# EasyEDA Pro project 二版平衡车pcb.epro, board PCB1
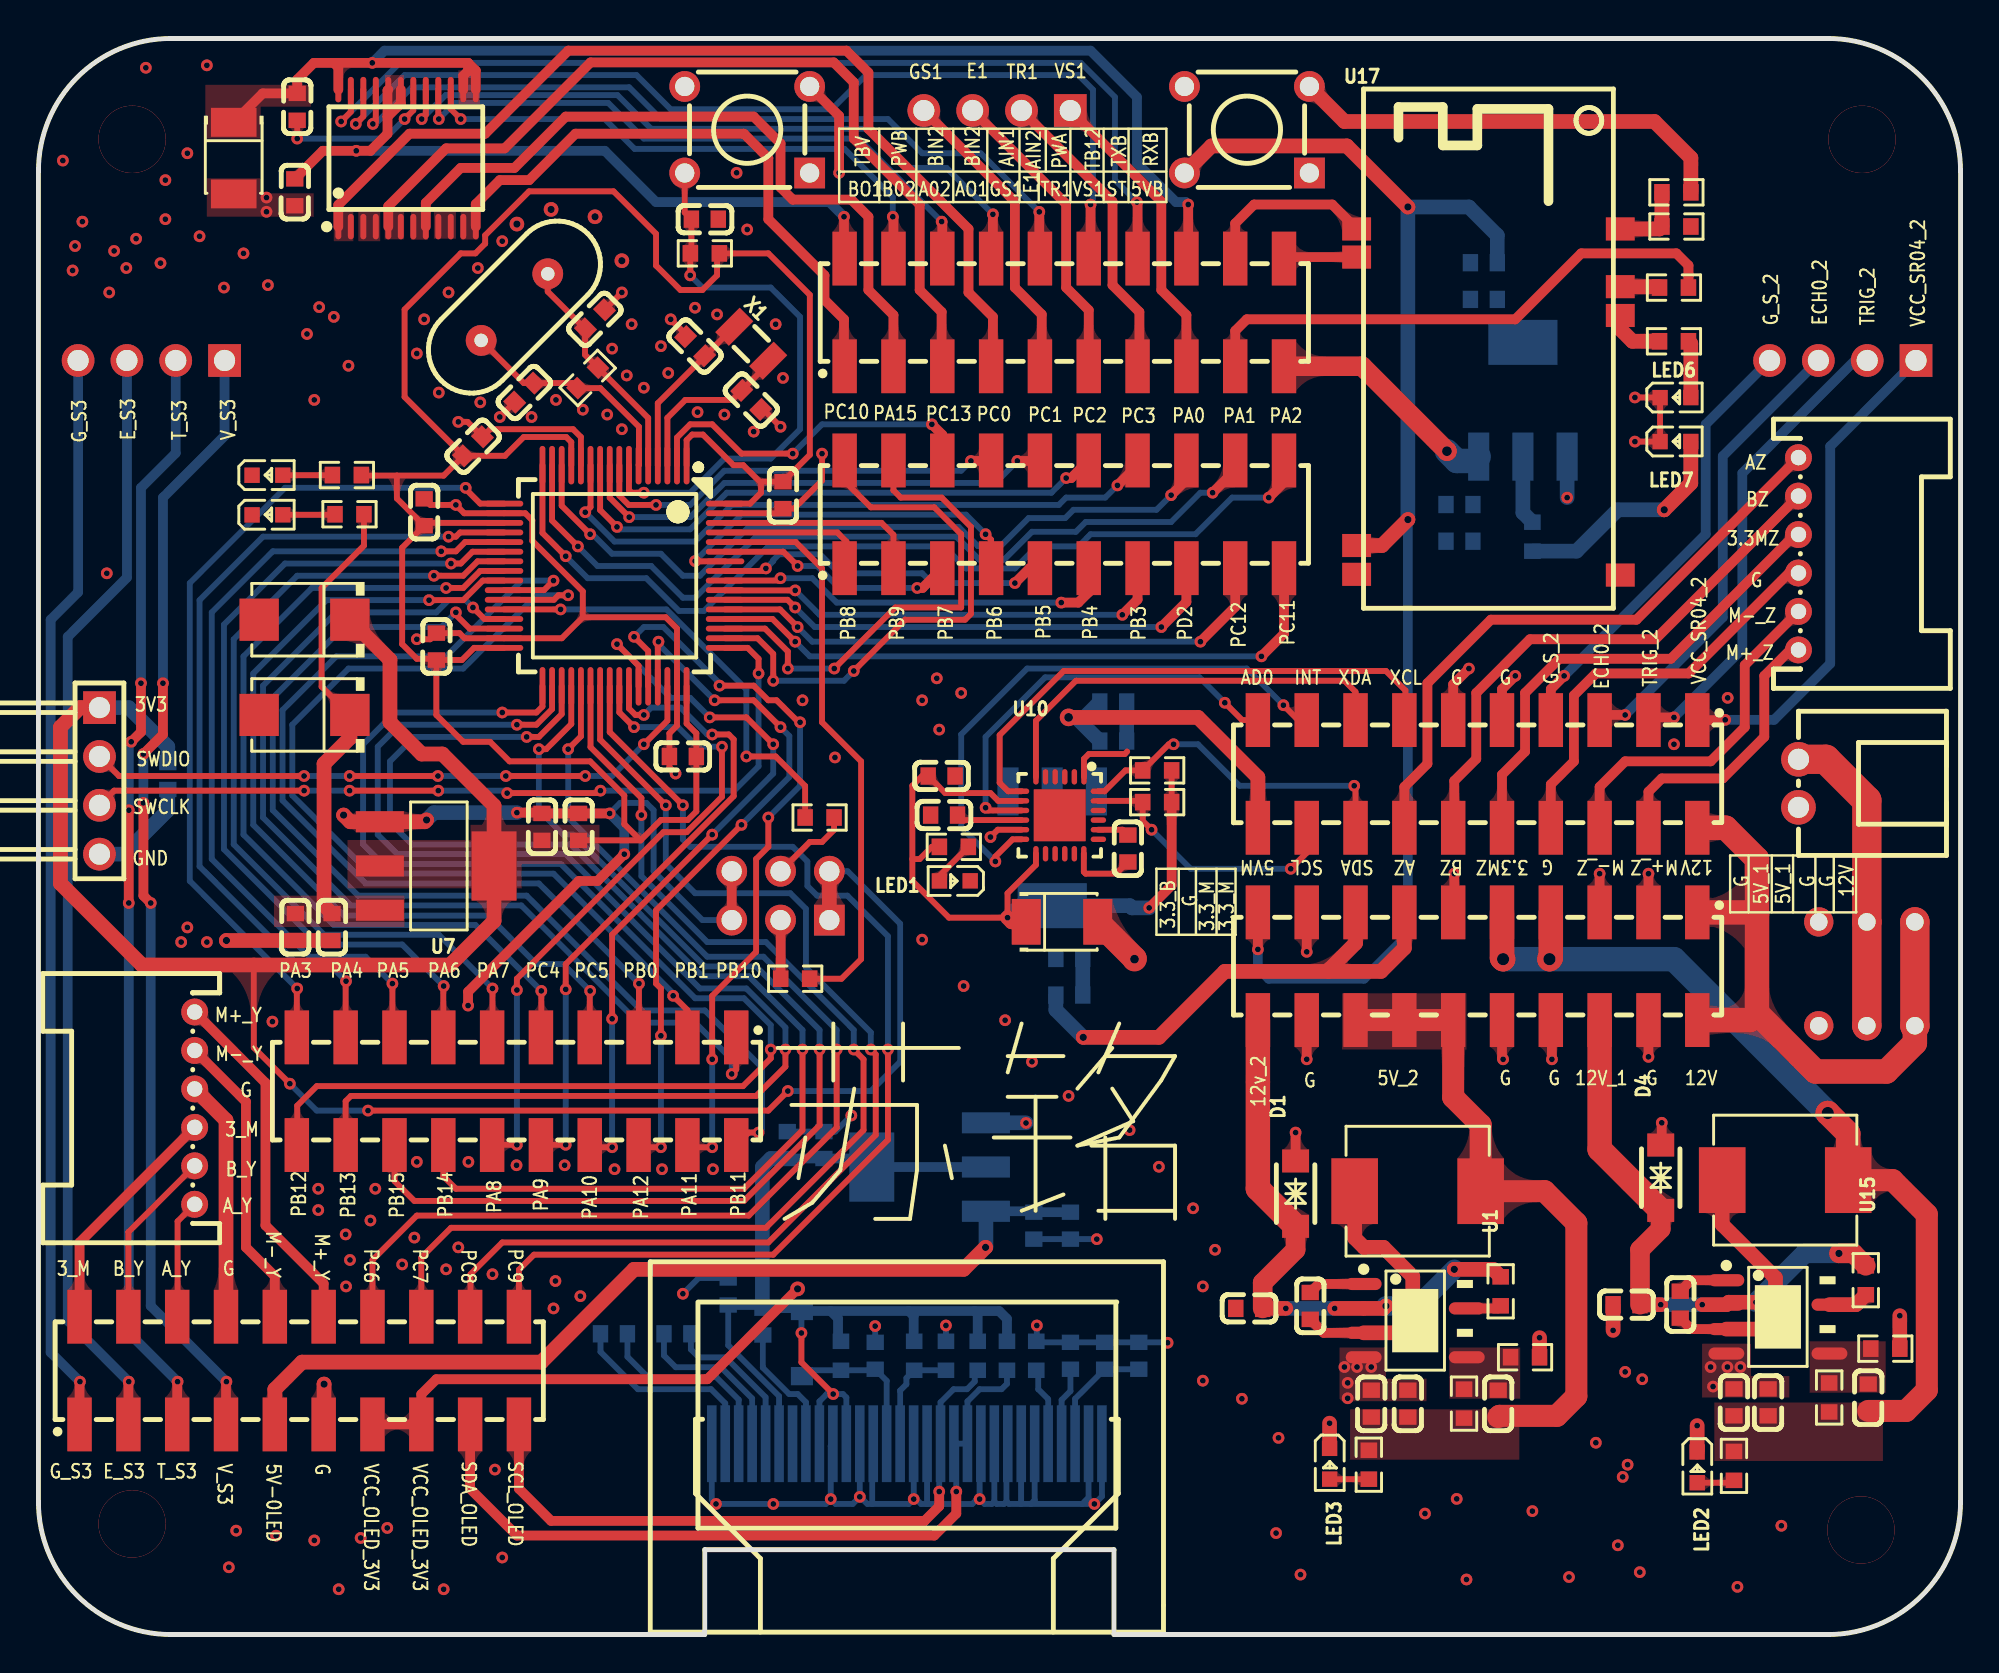
[diagram p6: board, top side]
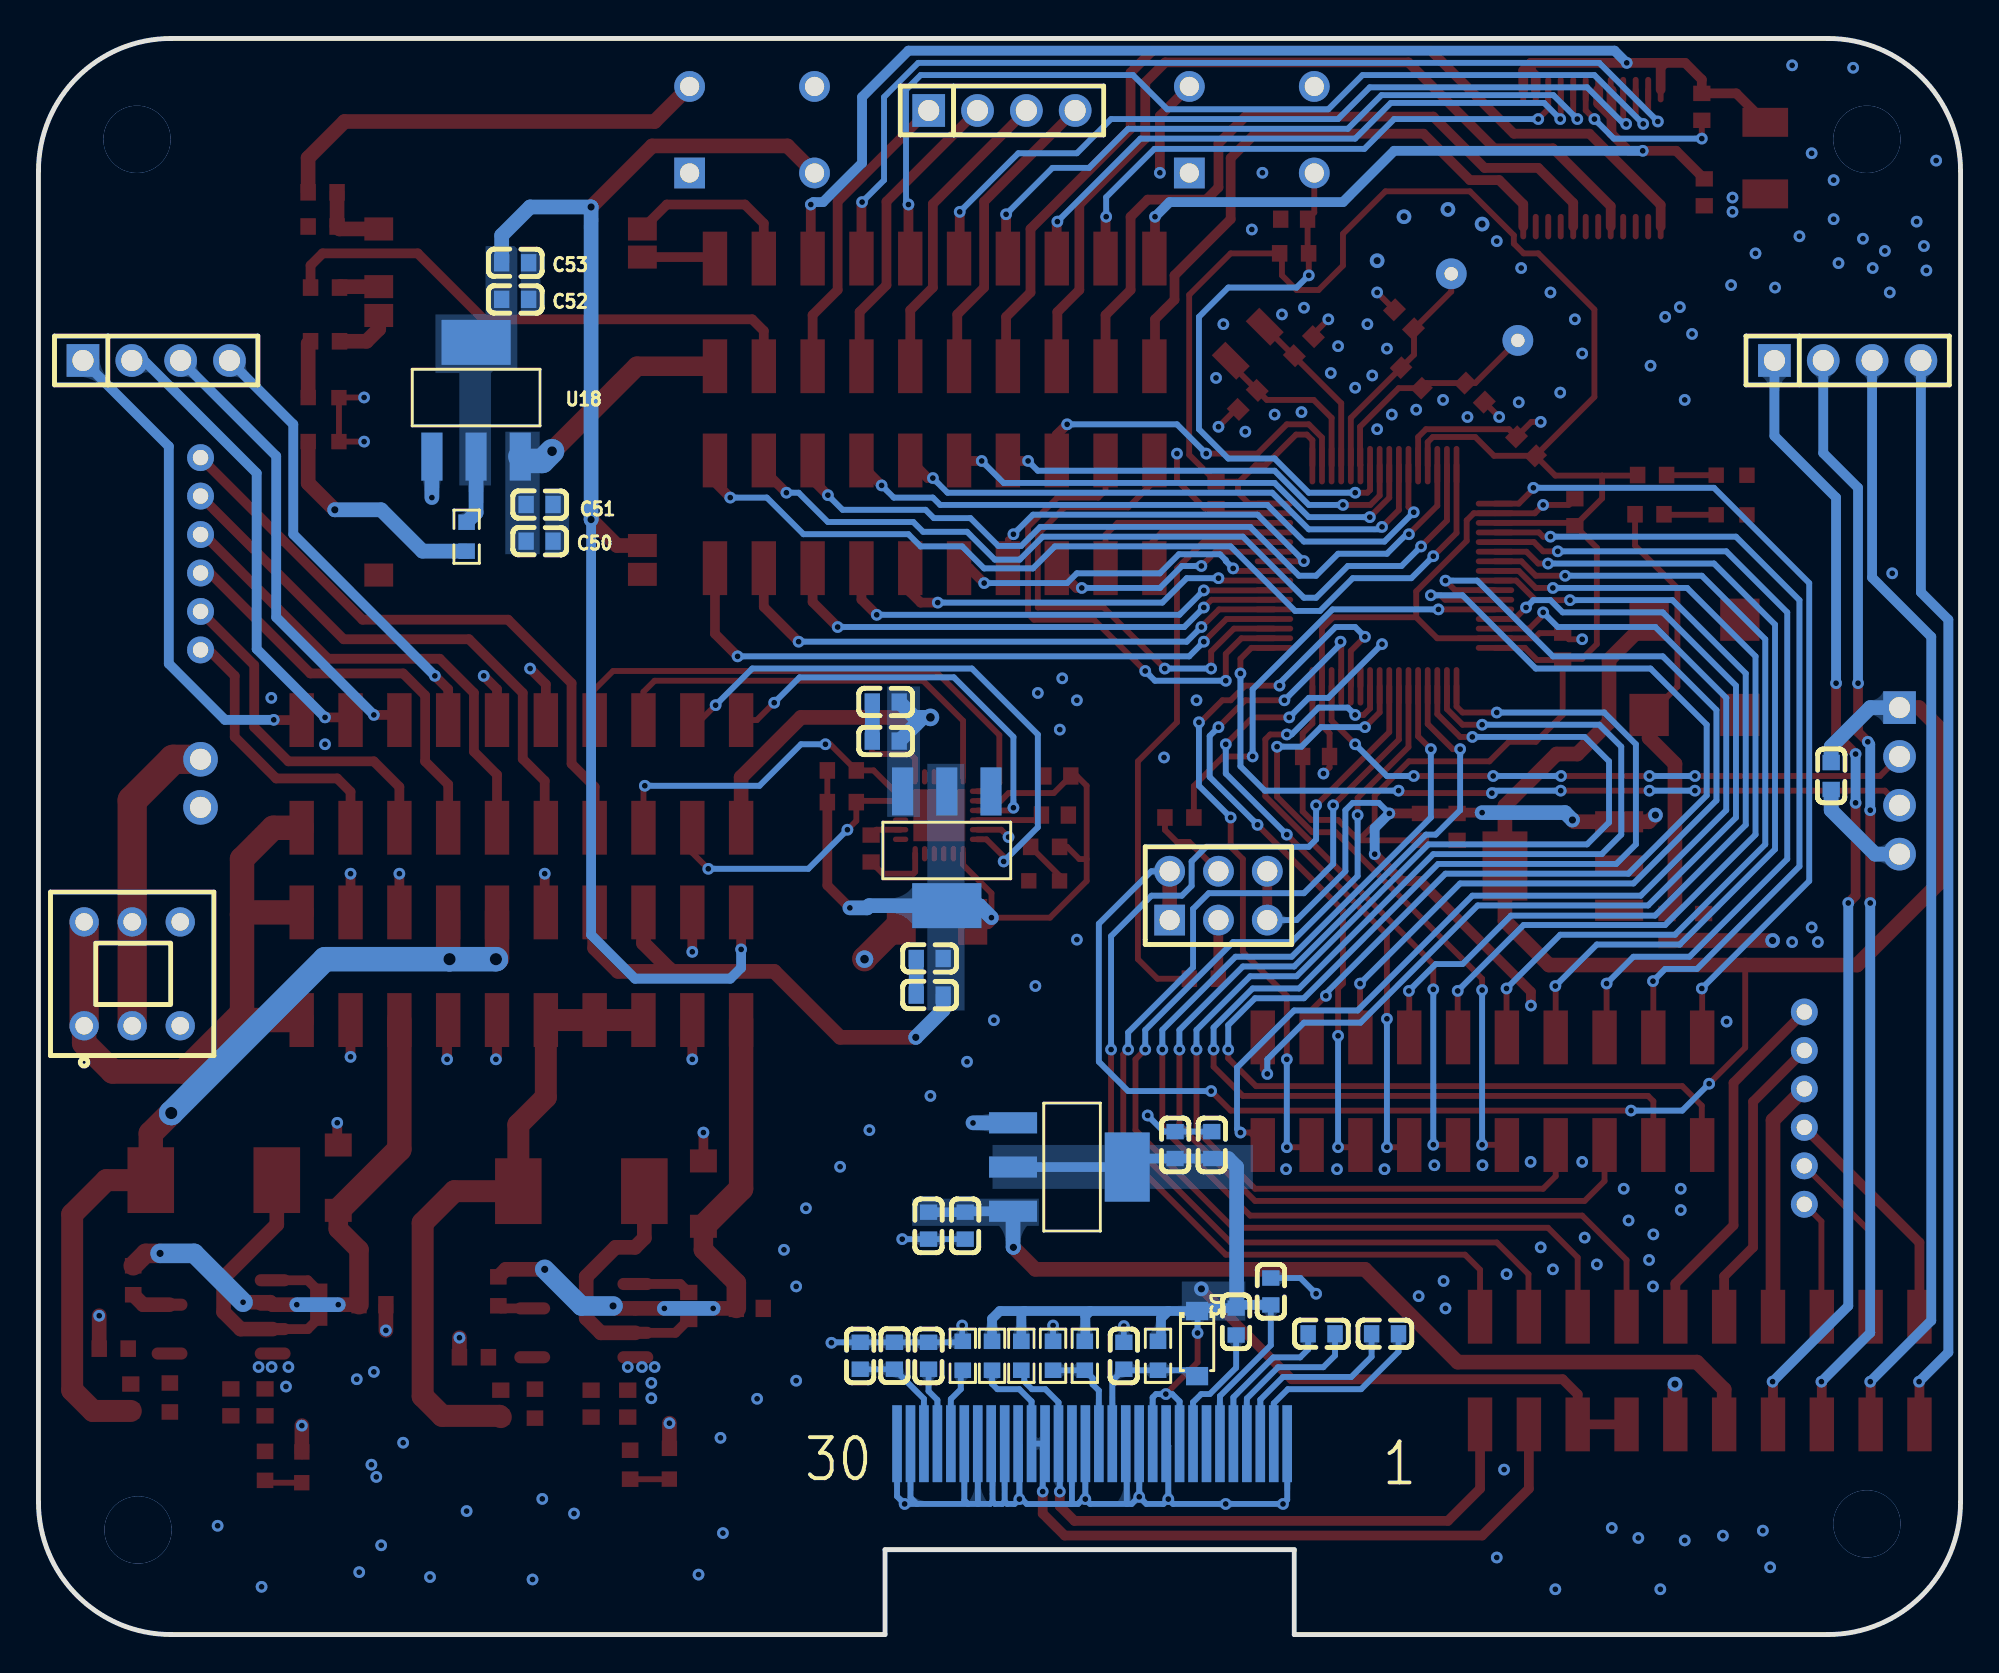
[diagram p7: board, bottom side, seen from below]

Outline 100 x 83 mm; copper layers: Top Layer, Bottom Layer. Coordinates in mm from the lower left corner of the outline.
Outline path: 0,76.1 0,6.9 arc(2.02,2.02) 6.9,0 34.67,0 34.67,4.41 55.96,4.41 55.96,0 93.1,0 arc(97.98,2.02) 100,6.9 100,76.1 arc(97.98,80.98) 93.1,83 6.9,83 arc(2.02,80.98) 0,76.1
Stack: Top Layer 0.035mm - / Dielectric1 1.51mm FR4 er 4.5 / Bottom Layer 0.035mm -

## Design rules (mm)
template: 自定义配置
spacing copperThickness1oz (default): track to track 0.102, other pairs 0.152 to 0.3
spacing copperThickness2oz: track to track 0.203, other pairs 0.152 to 0.3
track width copperThickness1oz (default): min 0.127, default 0.254, max 2.54
track width copperThickness2oz: min 0.203, default 0.254, max 2.54
differential pair differentialPair (default): width min 0.127, default 0.254, max 2.54; gap min 0.152, default 0.152
via viaSize (default): diameter min 0.5, default 0.61, max 10; hole min 0.3, default 0.305, max 6.3

## Placement (name value [footprint] x y rotation side)
C1  100nF  [C0603]  6.73 44.65 270 bottom
C2  100nF  [C0603]  38.73 59.25 90 top
C3  100nF  [C0603]  22.61 61.79 225 top
C4  100nF  [C0603]  20.07 58.36 270 top
C5  100nF  [C0603]  20.7 51.38 270 top
C6  100nF  [C0603]  33.53 45.66 0 top
C7  20pF  [C0603]  34.16 67 315 top
C8  20pF  [C0603]  37.08 64.2 135 top
C9  22pF  [C0603]  25.27 64.58 225 top
C10  22pF  [C0603]  28.96 68.39 45 top
C11  100nF  [C0603]  34.67 73.6 180 top
C12  10uF  [C0603]  62.99 16.96 0 top
C13  0.1uF  [C0603]  66.17 17.09 270 top
C14  100pF  [C0603]  75.95 12.01 90 top
C15  22uF  [C0603]  71.25 12.01 90 top
C16  22uF  [C0603]  69.34 12.01 90 top
C17  100nF  [C0603]  15.27 36.79 90 top
C18  100nF  [C0603]  13.37 36.79 90 top
C19  100nF  [C0603]  28.1 42 270 top
C20  100nF  [C0603]  26.19 42 270 top
C21  100nF  [C0603]  13.34 75 270 top
C22  100nF  [C0603]  13.46 79.44 270 top
C23  10uF  [CASE-B_3528]  10.16 76.78 270 top
C24  1uF  [C0603]  29.94 15.64 180 bottom
C25  1uF  [C0603]  33.24 15.64 180 bottom
C26  1uF  [C0603]  35.89 17.84 270 bottom
C27  2.2uF  [C0603]  37.69 16.27 90 bottom
C28  2.2uF  [C0603]  53.69 14.5 90 bottom
C29  2.2uF  [C0603]  57.25 14.5 90 bottom
C30  1uF  [C0603]  55.47 14.5 270 bottom
C31  4.7uF  [C0603]  43.53 14.5 90 bottom
C33  0.01uF  [C0603]  46.99 44.65 0 top
C34  0.1uF  [C0603]  47.12 42.61 0 top
C36  2200pF  [C0603]  56.68 40.87 90 top
C37  100nF  [C0603]  55.92 48.49 180 bottom
C38  100nF  [C0603]  55.92 46.46 180 bottom
C39  100nF  [C0603]  53.63 33.25 180 bottom
C40  100nF  [C0603]  53.63 35.16 180 bottom
C41  10uF  [C0603]  82.62 17.15 0 top
C42  0.1uF  [C0603]  85.42 17.15 270 top
C43  100pF  [C0603]  95.2 12.33 90 top
C44  22uF  [C0603]  89.99 12.07 90 top
C45  22uF  [C0603]  88.21 12.07 90 top
C46  100nF  [C0603]  53.69 21.26 90 bottom
C47  100nF  [C0603]  51.79 21.26 90 bottom
C48  100nF  [C0603]  40.86 25.45 270 bottom
C49  100nF  [C0603]  38.96 25.45 270 bottom
C50  100nF  [C0603]  73.93 56.86 0 bottom
C51  100nF  [C0603]  73.93 58.76 0 bottom
C52  100nF  [C0603]  75.2 69.43 0 bottom
C53  100nF  [C0603]  75.2 71.34 0 bottom
C54  0.1uF  [CASE-B_3528]  53.25 37.06 0 top
CN1  HX25003-2WAP  [CONN-TH_2P-P2.50_HX25003-2WAP]  91.57 44.26 90 top
D1  SMF15CA  [SOD-123FL_L2.8-W1.8-LS3.7-BI]  65.41 22.93 270 top
D3  1N4148W  [SOD-123_L2.8-W1.8-LS3.7-RD-1]  39.72 15.13 270 bottom
D4  SMF15CA  [SOD-123FL_L2.8-W1.8-LS3.7-BI]  84.4 23.76 270 top
D5  SMBJ3.3A  [SMB_L4.6-W3.6-LS5.3-RD]  13.84 52.77 180 top
D6  SMBJ5.0A  [SMB_L4.6-W3.6-LS5.3-RD]  13.84 47.82 180 top
H1  -  [HDR-TH_6P-P2.54-V-R2-C3-S2.54_A2541WV-2X3P]  38.61 38.42 180 bottom
H2  -  [HDR-TH_4P-P2.54-V-F]  49.87 79.25 180 bottom
H3  -  [HDR-TH_4P-P2.54-V-F]  93.87 66.25 180 bottom
H4  -  [HDR-TH_4P-P2.54-V-F]  5.87 66.25 180 bottom
HDR1  PZ254-2-10-S  [HDR-SMD_20P-P2.54-V-M-R2-C10-S7.4]  53.37 68.75 0 top
HDR2  PZ254-2-10-S  [HDR-SMD_20P-P2.54-V-M-R2-C10-S7.4]  53.37 58.25 0 top
HDR3  PZ254-2-10-S  [HDR-SMD_20P-P2.54-V-M-R2-C10-S7.4]  74.87 44.75 180 top
HDR5  PZ254-2-10-S  [HDR-SMD_20P-P2.54-V-M-R2-C10-S7.4]  13.57 13.73 0 top
HDR6  PZ254-2-10-S  [HDR-SMD_20P-P2.54-V-M-R2-C10-S7.4]  24.87 28.25 180 top
HDR7  PZ254-2-10-S  [HDR-SMD_20P-P2.54-V-M-R2-C10-S7.4]  74.87 34.75 180 top
KEY1  AN6*6  [KEY-TH_4P-L6.0-W6.0-P6.50-LS4.5]  36.87 78.25 180 top
KEY2  AN6*6  [KEY-TH_4P-L6.0-W6.0-P6.50-LS4.5]  62.87 78.25 180 top
L3  4.7uH  [IND-SMD_L7.3-W6.6]  71.76 23.06 0 top
L4  4.7uH  [IND-SMD_L7.3-W6.6]  90.88 23.63 0 top
LED1  -  [LED_0603]  47.63 39.18 180 top
LED2  -  [LED_0603]  86.31 8.64 270 top
LED3  -  [LED_0603]  67.18 8.83 270 top
LED4  -  [LED_0603]  11.96 58.23 0 top
LED5  -  [LED_0603]  11.96 60.3 0 top
LED6  -  [LED_0603]  85.22 64.33 0 top
LED7  -  [LED_0603]  85.22 62.04 0 top
R1  1MΩ  [R0603]  28.58 65.35 45 top
R5  10kΩ  [R0603]  39.37 34.1 180 top
R6  10kΩ  [R0603]  40.64 42.49 180 top
R7  11.3K  [R0603]  77.34 14.42 180 top
R8  50K  [R0603]  74.17 12.01 90 top
R9  100K  [R0603]  76.07 17.85 90 top
R10  560k  [R0603]  51.91 14.5 270 bottom
R11  4.7k  [R0603]  41.75 14.5 90 bottom
R12  4.7k  [R0603]  47.21 14.5 90 bottom
R13  NC/4.7k  [R0603]  45.56 14.5 270 bottom
R14  4.7k  [R0603]  48.86 14.5 90 bottom
R15  4.7k  [R0603]  50.39 14.5 90 bottom
R16  4.7K  [R0603]  58.2 44.94 0 top
R17  4.7K  [R0603]  58.2 43.29 0 top
R18  330  [R0603]  47.63 40.96 0 top
R19  11.3K  [R0603]  96.08 14.87 180 top
R20  50K  [R0603]  93.16 12.33 90 top
R21  100K  [R0603]  95.07 18.42 90 top
R22  1K  [R0603]  16.18 58.26 180 top
R23  330  [R0603]  16.05 60.3 180 top
R30  1K  [R0603]  77.72 57.09 270 bottom
R31  510  [R0603]  85.22 75 0 top
R32  10K  [R0603]  85.22 73.22 180 top
R33  10K  [R0603]  85.09 70.05 180 top
R34  10K  [R0603]  85.09 67.25 180 top
R35  1k  [R0603]  69.22 8.83 90 top
R36  1k  [R0603]  88.21 8.77 90 top
SW1  TK-6850-1  [SW-TH_TK-6850-1]  95.12 34.36 180 bottom
U1  CN3903  [ESOP-8_L4.9-W3.9-P1.27-LS6.0-BL-EP-1]  71.63 16.32 270 top
U2  STM32F103RCT6  [LQFP-64_L10.0-W10.0-P0.50-LS12.0-BL]  29.97 55.06 180 top
U5  10kΩ  [R0603]  34.67 71.82 0 top
U6  PZ2.54-1*4-WZ  [HDR-TH_4P-P2.54-H-M-W7.7-P]  3.18 44.39 270 top
U7  AMS1117-3.3  [SOT-223-3_L6.5-W3.4-P2.30-LS7.0-BR]  20.73 39.97 180 top
U9  TB6612FNG,C,8,EL  [SSOP-24_L8.3-W5.6-P0.65-LS7.6-BL]  19.18 76.78 0 top
U10  MPU-6050  [QFN-24_L4.0-W4.0-P0.50-BL-EP2.7]  53.14 42.6 180 top
U13  X096-2864KLBAG01-H30  [OLED-SMD_X096-2864KLBAG01-H30]  45.18 9.92 0 top
U14  AMS1117-3.3  [SOT-223-3_L6.5-W3.4-P2.30-LS7.0-BR]  52.74 40.87 90 bottom
U15  CN3903  [ESOP-8_L4.9-W3.9-P1.27-LS6.0-BL-EP-1]  90.5 16.52 270 top
U16  AMS1117-3.3  [SOT-223-3_L6.5-W3.4-P2.30-LS7.0-BR]  46.32 24.31 0 bottom
U17  HC-05  [BTK-05]  75.44 66.87 0 top
U18  AMS1117-3.3  [SOT-223-3_L6.5-W3.4-P2.30-LS7.0-BR]  77.23 64.22 270 bottom
X1  32.768kHz  [FC-135R_L3.2-W1.5]  37.08 67.12 315 top
X3  8MHz  [OSC-TH_L10.0-W4.5-P5.00]  24.77 69.03 315 top
右电机  右电机  [CONN-TH_6P-P2.00_HCTL_HC-HY-6AW]  8.13 27.37 270 top
左电机  左电机  [CONN-TH_6P-P2.00_HCTL_HC-HY-6AW]  91.57 56.2 90 top

## Footprints (pads in the part's own frame, mm; a bottom-side part is the same pattern mirrored in y, then rotated)
BTK-05
  rect 1.5x1.2 smd: 1(-6.858,6.223) 2(-6.858,4.761) 12(-6.858,-10.239) 13(-6.858,-11.739) 22(6.858,-11.777) 31(6.858,1.723) 32(6.858,3.223) 34(6.858,6.223)
C0603
  rect 0.8x0.9 smd: 1(-0.7,0) 2(0.7,0)
CASE-B_3528
  rect 1.506x2.376 smd: 1(-1.861,0) 2(1.861,0)
CONN-TH_2P-P2.50_HX25003-2WAP
  round 1.8 hole 1.1: 1(-1.25,0) 2(1.25,0)
CONN-TH_6P-P2.00_HCTL_HC-HY-6AW
  round 1.4 hole 0.8: 1(5,0) 2(3,0) 3(1,0) 4(-1,0) 5(-3,0) 6(-5,0)
ESOP-8_L4.9-W3.9-P1.27-LS6.0-BL-EP-1
  oval 0.63x1.865 smd: 1(-1.905,-2.683) 2(-0.635,-2.683) 3(0.635,-2.683) 4(1.905,-2.683) 5(1.905,2.683) 7(-0.635,2.683)
FC-135R_L3.2-W1.5
  rect 1x1.8 smd: 1(-1.25,0) 2(1.25,0)
HDR-SMD_20P-P2.54-V-M-R2-C10-S7.4
  rect 1.27x2.8 smd: 1(-11.43,-2.8) 2(-11.43,2.8) 3(-8.89,-2.8) 4(-8.89,2.8) 5(-6.35,-2.8) 6(-6.35,2.8) 7(-3.81,-2.8) 8(-3.81,2.8) 9(-1.27,-2.8) 10(-1.27,2.8) 11(1.27,-2.8) 12(1.27,2.8) 13(3.81,-2.8) 14(3.81,2.8) 15(6.35,-2.8) 16(6.35,2.8) 17(8.89,-2.8) 18(8.89,2.8) 19(11.43,-2.8) 20(11.43,2.8)
HDR-TH_4P-P2.54-H-M-W7.7-P
  rect 1.7x1.7 hole 1.1: 1(-3.81,0)
  round 1.7 hole 1.1: 2(-1.27,0) 3(1.27,0) 4(3.81,0)
HDR-TH_4P-P2.54-V-F
  rect 1.7x1.7 hole 1.1: 1(-3.81,0)
  round 1.7 hole 1.1: 2(-1.27,0) 3(1.27,0) 4(3.81,0)
HDR-TH_6P-P2.54-V-R2-C3-S2.54_A2541WV-2X3P
  rect 1.6x1.6 hole 1.05: 1(-2.54,-1.27)
  round 1.6 hole 1.05: 2(-2.54,1.27) 3(0,-1.27) 4(0,1.27) 5(2.54,-1.27) 6(2.54,1.27)
IND-SMD_L7.3-W6.6
  rect 2.424x3.42 smd: 1(3.278,0) 2(-3.278,0)
KEY-TH_4P-L6.0-W6.0-P6.50-LS4.5
  rect 1.6x1.6 hole 1: 1(-3.25,2.25)
  round 1.6 hole 1: 2(3.25,2.25) 3(-3.25,-2.25) 4(3.25,-2.25)
LED_0603
  rect 0.8x0.8 smd: 1(-0.851,-0.01) 2(0.75,-0.005)
LQFP-64_L10.0-W10.0-P0.50-LS12.0-BL
  oval 0.3x2 smd: 1(-3.75,-5.75) 2(-3.25,-5.75) 3(-2.75,-5.75) 4(-2.25,-5.75) 5(-1.75,-5.75) 6(-1.25,-5.75) 7(-0.75,-5.75) 8(-0.25,-5.75) 9(0.25,-5.75) 10(0.75,-5.75) 11(1.25,-5.75) 12(1.75,-5.75) 13(2.25,-5.75) 14(2.75,-5.75) 15(3.25,-5.75) 16(3.75,-5.75) 33(3.75,5.75) 34(3.25,5.75) 35(2.75,5.75) 36(2.25,5.75) 37(1.75,5.75) 38(1.25,5.75) 39(0.75,5.75) 40(0.25,5.75) 41(-0.25,5.75) 42(-0.75,5.75) 43(-1.25,5.75) 44(-1.75,5.75) 45(-2.25,5.75) 46(-2.75,5.75) 47(-3.25,5.75) 48(-3.75,5.75)
  oval 2x0.3 smd: 17(5.75,-3.75) 18(5.75,-3.25) 19(5.75,-2.75) 20(5.75,-2.25) 21(5.75,-1.75) 22(5.75,-1.25) 23(5.75,-0.75) 24(5.75,-0.25) 25(5.75,0.25) 26(5.75,0.75) 27(5.75,1.25) 28(5.75,1.75) 29(5.75,2.25) 30(5.75,2.75) 31(5.75,3.25) 32(5.75,3.75) 49(-5.75,3.75) 50(-5.75,3.25) 51(-5.75,2.75) 52(-5.75,2.25) 53(-5.75,1.75) 54(-5.75,1.25) 55(-5.75,0.75) 56(-5.75,0.25) 57(-5.75,-0.25) 58(-5.75,-0.75) 59(-5.75,-1.25) 60(-5.75,-1.75) 61(-5.75,-2.25) 62(-5.75,-2.75) 63(-5.75,-3.25) 64(-5.75,-3.75)
OLED-SMD_X096-2864KLBAG01-H30
  rect 0.5x4 smd far side: 1(-10.15,0) 2(-9.45,0) 3(-8.75,0) 4(-8.05,0) 5(-7.35,0) 6(-6.65,0) 7(-5.95,0) 8(-5.25,0) 9(-4.55,0) 10(-3.85,0) 11(-3.15,0) 12(-2.45,0) 13(-1.75,0) 14(-1.05,0) 15(-0.35,0) 16(0.35,0) 17(1.05,0) 18(1.75,0) 19(2.45,0) 20(3.15,0) 21(3.85,0) 22(4.55,0) 23(5.25,0) 24(5.95,0) 25(6.65,0) 26(7.35,0) 27(8.05,0) 28(8.75,0) 29(9.45,0) 30(10.15,0)
OSC-TH_L10.0-W4.5-P5.00
  round 1.6 hole 0.7: 1(0,2.45) 2(0,-2.45)
QFN-24_L4.0-W4.0-P0.50-BL-EP2.7
  oval 0.28x0.8 smd: 1(-1.25,-2) 2(-0.75,-2) 3(-0.25,-2) 4(0.25,-2) 5(0.75,-2) 6(1.25,-2) 13(1.25,2) 14(0.75,2) 15(0.25,2) 16(-0.25,2) 17(-0.75,2) 18(-1.242,2)
  oval 0.8x0.28 smd: 7(2,-1.25) 8(2,-0.75) 9(2,-0.25) 10(2,0.25) 11(2,0.75) 12(2,1.25) 19(-2,1.25) 20(-2,0.75) 21(-2,0.25) 22(-2,-0.25) 23(-2,-0.75) 24(-2,-1.25)
  rect 2.7x2.7 smd: 25(0.013,0)
R0603
  rect 0.806x0.864 smd: 1(-0.753,0) 2(0.753,0)
SMB_L4.6-W3.6-LS5.3-RD
  rect 2.047x2.192 smd: 1(-2.361,0) 2(2.361,0)
SOD-123_L2.8-W1.8-LS3.7-RD-1
  rect 0.95x1.15 smd: 1(-1.692,0) 2(1.692,0)
SOD-123FL_L2.8-W1.8-LS3.7-BI
  rect 1.2x1.4 smd: 1(-1.7,0) 2(1.7,0)
SOT-223-3_L6.5-W3.4-P2.30-LS7.0-BR
  rect 2.5x1.1 smd: 1(2.97,-2.3) 2(2.97,0) 3(2.97,2.3)
  rect 2.34x3.6 smd: 4(-2.97,0)
SSOP-24_L8.3-W5.6-P0.65-LS7.6-BL
  oval 0.308x1.324 smd: 1(-3.575,-3.562) 2(-2.925,-3.562) 3(-2.275,-3.562) 4(-1.625,-3.562) 5(-0.975,-3.562) 6(-0.325,-3.562) 7(0.325,-3.562) 8(0.975,-3.562) 9(1.625,-3.562) 10(2.275,-3.562) 11(2.925,-3.562) 12(3.575,-3.562) 13(3.575,3.562) 14(2.925,3.562) 15(2.275,3.562) 16(1.625,3.562) 17(0.975,3.562) 18(0.325,3.562) 19(-0.325,3.562) 20(-0.975,3.562) 21(-1.625,3.562) 22(-2.275,3.562) 23(-2.925,3.562) 24(-3.575,3.562)
SW-TH_TK-6850-1
  round 1.524 hole 0.914: 1(-2.5,-2.7) 2(0,-2.7) 3(2.5,-2.7) 4(-2.5,2.7) 5(0,2.7) 6(2.5,2.7)

## Nets
As in the schematic, except:
GND_MOTOR_Y: HDR5.8 右电机.4
GND_MOTOR_Z: HDR3.8 左电机.4
VCC_3V3_MOTOR_Y: HDR5.2 右电机.3
VCC_3V3_MOTOR_Z: HDR3.10 左电机.3

Pads without a net: KEY1 1 4; KEY2 1 4; SW1 3 6; U10 2 3 4 5 14 15 16 17 19 21 22 25; U13 7

## Via types
v1: diameter 3.5, hole 3.5, Top Layer to Bottom Layer, 4 vias
v2: diameter 0.61, hole 0.305, Top Layer to Bottom Layer, 358 vias
v3: diameter 0.762, hole 0.381, Top Layer to Bottom Layer, 17 vias
v4: diameter 0.914, hole 0.457, Top Layer to Bottom Layer, 2 vias
v5: diameter 1.27, hole 0.635, Top Layer to Bottom Layer, 3 vias
v6: diameter 1.016, hole 0.508, Top Layer to Bottom Layer, 1 via

## Routing (per net, layer and track width the routed paths; a pad name or vN(x,y) marks a point on that pad's centre or on a via; arc(x,y) is an arc through that point)
5V_1: length 46.5
  Top Layer w1.143: C43.1 97.16,11.63 98.24,12.71 98.24,21.85 96.47,23.63 L4.1
  Top Layer w1.27: v5(78.61,35.12) 78.68,35.19 HDR7.7 ; v5(93.09,27.12) 94.16,26.05 L4.1 ; HDR7.9 76.14,35.18 v5(76.2,35.12)
  Bottom Layer w1.27: v5(76.2,35.12) v5(78.61,35.12) 85.09,35.12 v5(93.09,27.12)
5V_2: length 33.8
  Top Layer w1.143: HDR7.16 HDR7.14 HDR7.12 73.6,27.94 75.03,26.51 L3.1 78.36,23.06 80.01,21.4 80.01,12.39 78.99,11.37 76.01,11.37 C14.1
5V_BLUE: length 12.3
  Top Layer w1.016: HDR1.19 68.86,65.95 v6(73.28,61.54)
  Bottom Layer w1.27: U18.3 74.71,61.03 73.79,61.03 v6(73.28,61.54)
5V_MPU: length 17.4
  Top Layer w0.762: HDR3.20 63.44,44.58 60.33,47.69 v4(53.59,47.69)
  Bottom Layer w0.762: v4(53.59,47.69) 54.04,47.69 ; 54.04,47.69 54.04,47.64 C38.2 ; 54.04,47.69 54.42,47.69 C37.2
5V_OLED: length 48.2
  Top Layer w0.762: v3(49.28,20.13) 48.13,18.99 30.99,18.99 26.16,14.17 13.72,14.17 12.3,12.75 HDR5.9
  Bottom Layer w0.508: C46.2 C47.2 51.74,22.01 U16.3
  Bottom Layer w0.762: v3(49.28,20.13) 49.29,20.15 U16.3
5V_STM: length 23
  Top Layer w0.305: D6.1 14.73,49.29 14.73,54.42 16.94,56.63 R22.1
  Top Layer w0.762: D6.1 16.2,46.63 14.86,45.28 14.86,37.91 C17.2
12V: length 34.6
  Top Layer w1.27: 89.41,37.45 89.41,40.33 87.78,41.95 HDR3.2 ; 89.41,37.45 89.41,32.33 ; 89.41,37.45 89.3,37.55 HDR7.1 ; 89.41,32.33 92.46,29.28 96.14,29.28 97.62,30.76 SW1.1 ; 89.41,32.33 89.04,31.95 HDR7.2
  Top Layer w1.524: SW1.4 SW1.1
12V_1: length 29.7
  Top Layer w0.762: v2(86.56,17.15) U15.2 87.94,17.28 v2(89.35,17.28) ; v2(84.4,17.15) C41.2
  Top Layer w1.016: D4.2 84.4,21.09 83.32,20.01 C41.2 ; R21.2 94.43,19.82 v3(93.67,19.82)
  Top Layer w1.27: D4.2 81.22,25.24 HDR7.6
  Bottom Layer w0.762: v2(84.4,17.15) v2(86.56,17.15)
  Bottom Layer w1.016: v3(93.67,19.82) 91.89,19.82 v2(89.35,17.28)
12V_2: length 29.9
  Top Layer w0.762: v2(67.44,16.96) U1.2 69.98,16.96 v3(70.1,17.09) ; R9.2 75.68,18.99 v3(73.66,18.99) ; C12.2 v2(64.9,16.96)
  Top Layer w1.016: D1.2 65.41,20.01 63.69,18.29 C12.2
  Top Layer w1.27: HDR7.20 63.44,23.19 D1.2
  Bottom Layer w0.762: v2(64.9,16.96) v2(67.44,16.96)
  Bottom Layer w1.016: v3(73.66,18.99) 71.76,17.09 v3(70.1,17.09)
12V_3: length 16.2
  Top Layer w1.524: SW1.2 SW1.5 95.12,43.38 92.98,45.51 CN1.2
GND: length 259.7
  Top Layer w0.305: 28.32,52.9 28.32,54.25 25.69,56.87 25.69,57.94 25.33,58.31 U2.18 22.15,58.31 v2(21.72,58.74) 20.39,58.74 C4.1 ; 28.32,52.9 27.23,51.81 U2.31 22.17,51.81 21.91,52.08 C5.1 20.38,51.76 v2(19.69,51.76) ; 28.32,52.9 32.64,52.9 33.22,52.32 U2.47 33.22,47.26 32.83,46.87 C6.1 32.83,45.09 v2(33.15,44.77) ; 56.64,45.92 56.52,45.79 54.65,45.79 54.39,45.53 U10.1 ; C10.2 v2(30.35,69.79) ; v2(40.77,61.41) 40.77,60.01 39.3,58.55 C2.1 38.49,58.31 U2.63 ; v2(83.06,64.33) 84.36,64.33 LED6.1 LED7.1 v2(83.06,62.03) ; U10.18 54.39,39.66 54.48,39.57 56.07,39.57 C36.1 ; v2(19.05,78.81) 19.5,79.26 U9.18 ; v2(49.53,41.47) 49.91,41.85 U10.11 ; v2(32.89,68.39) 33.67,67.62 33.67,67.49 ; v2(13.46,77.79) C22.2 ; v2(21.84,63.06) 22.33,63.06 C3.1 23.5,62.68 27.81,62.68 28.22,62.27 U2.12 ; v2(38.61,62.81) 37.71,63.71 C8.1 ; 24.78,64.09 v2(24,63.31)
  Top Layer w0.508: v2(76.83,49.85) 76.14,49.16 HDR3.9 ; D4.1 84.45,25.51 v2(84.45,26.61) ; v2(22.35,32.71) 22.35,33.43 28.11,39.18 29.08,39.18 v2(30.48,40.58) ; HDR7.10 76.14,29.97 v2(76.2,29.91) ; v2(29.72,42.7) 26.19,42.7 26.15,42.74 v2(24.89,42.74) ; v2(73.66,39.57) 73.66,37.61 HDR7.11 ; HDR7.17 v2(65.98,35.5) ; HDR7.3 v2(83.76,39.57) ; KEY1.3 41.66,78.97 v2(41.66,76.01) ; v2(74.42,50.23) 73.6,49.41 HDR3.11 ; H1.5 H1.6 ; HDR7.5 v2(81.22,39.57) ; v2(78.74,29.91) 78.74,31.9 HDR7.8 ; HDR7.18 v2(65.98,29.91) ; D1.1 v2(65.41,26.1) ; HDR7.4 v2(83.76,30.04)
  Top Layer w0.762: R7.1 v2(78.1,15.44) ; HDR5.11 14.86,10.95 v3(14.86,13.02) ; v3(20.19,42.36) 20.1,42.27 U7.1 16.22,42.27 v3(15.88,42.61) ; C17.1 C18.1 v3(9.78,36.09) ; LED2.1 v2(86.3,10.86) ; C41.1 v2(81.92,15.82) ; LED3.1 v2(67.17,10.99) ; R19.1 v2(96.84,16.58)
  Top Layer w1.27: v4(57.02,35.12) 57.02,35.15 C54.2
  Bottom Layer w0.305: v2(41.22,7.04) 41.22,9.81 U13.10 ; v2(41.22,7.04) 41.47,6.79 42.36,6.79 v2(42.73,7.16) 42.73,7.18 ; v2(41.22,7.04) 40.97,6.79 v2(38.23,6.79) v2(35.25,6.79) 35.03,7.01 U13.1 ; U13.22 49.73,6.92 ; 49.73,6.92 49.6,6.79 49.22,6.79 v2(48.97,7.04) 48.97,7.17 ; 49.73,6.92 49.73,6.91 49.86,6.79 50.24,6.79 50.36,6.92 ; U13.21 48.97,9.86 48.97,7.17 ; v2(58.75,15.17) 58.72,15.2 C29.2 C30.1 C28.2 51.97,15.2 51.94,15.22 ; 42.73,7.18 U13.12 ; 42.73,7.18 43.12,6.79 43.38,6.79 ; 54.3,6.79 v2(54.94,6.79) 55.33,7.19 U13.30 ; 54.3,6.79 54.63,7.12 U13.29 ; 54.3,6.79 51.63,6.79 ; U13.24 51.13,9.92 51.13,6.79 ; 51.94,15.22 v2(51.94,16.07) ; 51.94,15.22 R10.1 ; 46.23,6.79 48.58,6.79 48.97,7.17 ; 46.23,6.79 U13.17 ; 46.23,6.79 45.92,6.79 45.54,7.17 ; U13.25 51.83,6.99 51.63,6.79 ; 45.54,7.17 45.54,9.92 U13.16 ; 45.54,7.17 v2(45.54,7.04) 45.28,6.79 43.38,6.79 ; 51.13,6.79 51.63,6.79 ; 51.13,6.79 50.49,6.79 50.36,6.92 ; 43.38,6.79 43.38,9.87 U13.13 ; C47.1 C46.1 v2(55.06,20.56) ; v2(13.46,77.79) 18.03,77.79 v2(19.05,78.81) ; U13.23 50.36,9.86 50.36,6.92 ; C26.1 34.35,18.54 v2(33.53,17.72) ; C49.1 C48.1 41.45,26.15 v2(42.29,26.99) ; 43.56,16.07 v2(43.53,16.04) C31.2 ; v2(29.72,42.7) 30.27,43.25 31.62,43.25 32,42.87 32,39.69 34.54,37.15 H1.5 ; R12.2 v2(47.21,16.07)
  Bottom Layer w0.508: v2(30.48,40.58) 30.48,41.94 v2(29.72,42.7)
  Bottom Layer w0.762: U16.1 51.38,26.61 ; C39.1 C40.1 ; U6.4 4.45,40.58 6.73,42.87 C1.2 ; C37.1 C38.1 ; U18.1 v2(79.53,59.12) ; v3(20.19,42.36) 20.57,42.74 v2(24.89,42.74)
  vias: v2(1.27,76.65) v2(1.78,70.93) v2(1.91,72.2) v2(2.29,73.47) v2(3.56,55.19) v2(3.68,69.79) v2(3.94,71.95) v2(4.57,71.06) v2(5.08,72.59) v2(5.59,81.48) v2(6.35,71.32) v2(6.6,75.63) v2(6.6,73.6) v2(7.43,36.01) v2(7.75,77.03) v2(7.75,36.77) v2(8.38,72.71) v2(8.76,81.6) v2(8.76,36.01) v2(9.65,70.05) v2(9.91,3.5) v2(10.29,5.4) v2(10.67,71.82) v2(11.87,74.73) v2(11.87,73.99) v2(11.94,70.17) v2(12.17,31.87) v2(12.36,5.14) v2(13.97,67.63) v2(14.35,64.2) v2(14.35,4.89) v2(14.61,69.03) v2(14.56,23.18) v2(14.56,22.07) v2(15.37,68.52) v2(15.62,2.35) v2(15.98,20.81) v2(16,18.1) v2(16.13,65.98) v2(16.21,19.48) v2(16.76,5.02) v2(17.27,21.53) v2(17.53,23.18) v2(18.15,5.54) v2(18.92,19.25) v2(19.56,20.64) v2(19.69,66.62) v2(19.69,24.58) v2(20.07,68.39) v2(20.83,64.58) v2(21.08,2.35) v2(21.21,18.99) v2(21.34,69.79) v2(21.84,20.13) v2(22.37,24.58) v2(22.86,71.06) v2(22.99,64.08) v2(23.62,18.74) v2(23.75,8.58) v2(24.13,72.46) v2(24.13,4.01) v2(24.87,24.4) v2(25.65,63.31) v2(26.8,16.96) v2(26.9,18.38) v2(26.92,64.2) v2(27.38,24.4) v2(28.19,17.59) v2(28.32,63.7) v2(29.59,63.44) v2(29.85,66.87) v2(29.97,24.2) v2(30.35,62.68) v2(30.61,65.47) v2(30.86,68.14) v2(31.5,64.84) v2(32.39,67) v2(32.44,24.2) v2(32.77,65.6) v2(34.16,69) v2(34.29,63.57) v2(35.09,24.2) v2(35.31,68.65) v2(35.69,63.44) v2(36.32,76.01) v2(36.87,73.07) v2(37.21,62.55) v2(38.35,68.14) v2(38.73,65.35) v2(39.75,48.58) v2(41.44,45.61) v2(45.97,48.58) v2(45.97,36.14) v2(46.74,49.73) v2(46.86,47.06) v2(48.01,48.96) v2(48.13,33.72) v2(50.29,31.95) v2(51.38,26.6) v2(51.69,29.79) v2(53.59,28.01) v2(56.77,26.23) v2(58.29,24.33) v2(60.07,22.17) v2(60.58,18.1) v2(60.58,13.2) v2(61.21,20.01) v2(62.61,12.26) v2(64.39,5.28) v2(64.52,10.23) v2(65.66,3.12) v2(67.95,13.91) v2(68.11,13.09) v2(68.11,12.29) v2(68.6,13.91) v2(69.34,13.91) v2(72.14,6.29) v2(73.79,7.05) v2(74.3,2.86) v2(77.72,6.42) v2(79.63,2.99) v2(81.03,9.97) v2(82.17,4.64) v2(82.42,8.2) v2(82.55,13.66) v2(82.68,8.83) v2(83.31,3.24) v2(83.44,13.28) v2(85.09,46.3) v2(87,13.91) v2(87.12,12.9) v2(87.88,48.71) v2(87.87,13.91) v2(88.39,2.48) v2(88.55,13.91) v2(90.68,5.66) v3(24.89,73.35) v3(26.67,74.11) v3(28.96,73.73) v3(30.35,71.44)
GND_MOTOR_Y: length 12.5
  Top Layer w0.762: 9.76,16.53 9.76,26.74 右电机.4
GND_MOTOR_Z: length 21.7
  Top Layer w0.508: HDR3.8 78.68,44.21 79.88,45.41 79.88,48.84 81.03,49.98 85.85,49.98 91.08,55.2 左电机.4
GND_SR04_1: length 15.9
  Top Layer w0.508: H2.4 50.8,74.52 50.8,70.05 52.2,68.65 52.2,66.05 HDR1.9
GND_SR04_2: length 23.4
  Top Layer w0.508: v2(79.38,49.85) 78.68,49.16 HDR3.7
  Bottom Layer w0.508: H3.4 86.74,62.93 86.74,57.22 v2(79.38,49.85)
GND_SR04_3: length 56.6
  Top Layer w0.508: v2(2.16,13.15) 2.14,13.13 HDR5.1
  Bottom Layer w0.508: H4.4 2.06,54.2 0.64,52.77 0.64,14.67 v2(2.16,13.15)
VCC_3V3: length 237.4
  Top Layer w0.305: U2.48 33.72,47.37 34.23,46.87 C6.2 34.23,42.81 33.78,42.36 32.39,42.36 31.32,41.3 ; 18.65,60.27 16.83,60.27 R23.1 ; 18.65,60.27 18.65,59.08 C4.2 ; 18.65,60.27 21.08,60.27 C3.2 ; C3.2 19.05,64.36 19.05,68.9 21.97,71.82 22.73,71.82 23.24,72.33 23.24,72.76 25.53,75.05 29.92,75.05 32.13,72.84 32.13,71.19 33.4,69.92 34.54,69.92 35.31,70.68 35.31,71.71 U5.2 37.97,71.82 40.13,69.66 40.13,61.35 C2.2 37.66,59.95 37.59,59.89 ; C3.2 24.27,61.3 25.25,62.27 27.46,62.27 27.72,62.01 U2.13 ; 37.59,59.89 36.67,60.81 36.16,60.81 34.57,62.4 34.01,62.4 33.72,62.11 U2.1 ; 37.59,59.89 37.59,59.38 37.02,58.81 U2.64 ; C5.2 20.64,50.74 19.69,50.74 18.92,51.5 18.92,56.52 C4.2 ; C5.2 22.03,50.68 22.67,51.31 U2.32 ; C5.2 20.7,47.82 22.1,46.42 23.5,46.42 24.51,45.41 28.7,45.41 30.48,43.63 30.48,42.14 31.32,41.3 ; 11.2,34.82 11.2,30.52 v2(13.08,28.64) ; C4.2 20.21,57.81 U2.19 ; C19.2 31.32,41.3 ; v2(38.99,28.26) 37.97,27.25 v2(17.15,27.25)
  Top Layer w0.762: D5.1 18.29,50.69 18.29,47.44 19.94,45.79 21.02,45.79 23.7,43.1 U7.4 23.7,37.11 21.41,34.82 5.39,34.82 1.14,39.06 1.14,47.19 2.16,48.2 U6.1 ; H1.2 H1.1
  Bottom Layer w0.305: v2(17.15,27.25) 14.48,27.25 v2(13.08,28.64) ; v2(38.99,28.26) 43.31,28.26 44.83,29.79 44.83,36.96 42.1,39.69 H1.2
  Bottom Layer w0.762: C1.1 6.73,46.17 4.7,48.2 U6.1
VCC_3V3_BLUE: length 76.8
  Top Layer w0.508: HDR7.19 v2(63.44,35.63)
  Top Layer w0.762: U17.12 69.9,56.63 v3(71.25,57.98) ; v3(71.25,74.24) 68.07,77.41 61.03,77.41 KEY2.2
  Bottom Layer w0.508: v2(63.44,35.63) 63.44,34.67 64.01,34.1 68.96,34.1 71.25,36.39 v3(71.25,57.98)
  Bottom Layer w0.762: R30.1 77.23,58.34 U18.2 ; v3(71.25,57.98) v3(71.25,74.24) 74.42,74.24 75.9,72.76 C53.2
VCC_3V3_MOTOR_Y: length 12.3
  Top Layer w0.508: 2.14,16.53 2.14,20.38 右电机.3
VCC_3V3_MOTOR_Z: length 25.1
  Top Layer w0.508: 左电机.3 91.39,57.2 84.93,50.74 79.12,50.74 77.34,48.96 77.34,45.92 76.14,44.72 HDR3.10
VCC_3V3_MPU6050: length 66
  Top Layer w0.305: R16.2 R17.2 ; U10.8 49.93,43.35 49.53,43.76 47.18,43.76 C33.1 45.97,44.65 45.47,44.14 45.47,40.33 ; U10.13 51.89,40.03 50.42,38.55 v2(50.42,37.28) 47.37,37.28 45.47,39.18 45.47,40.33 ; 45.47,40.33 45.85,40.33 46.48,40.96 R18.1
  Top Layer w0.508: v2(57.79,37.79) 58.96,38.96 R17.2
  Top Layer w0.762: HDR7.13 71.06,35.7 69.85,34.49 67.18,34.49 67.18,34.61 ; 67.18,34.61 67.06,34.49 61.72,34.49 58.29,31.06 v3(54.36,31.06) ; 67.18,34.61 68.52,35.95 HDR7.15 ; v2(50.42,37.28) 50.64,37.06 C54.1
  Bottom Layer w0.762: C39.2 52.93,32.48 v3(54.36,31.06) ; v2(57.79,37.79) 56.9,37.79 56.78,37.9 U14.4 51.04,37.9 v2(50.42,37.28)
VCC_OLED: length 85.9
  Top Layer w0.305: v2(39.7,15.68) 39.7,14.16 v2(41.35,12.51)
  Top Layer w0.508: v3(39.5,17.98) 34.8,13.28 20.7,13.28 19.92,12.49 HDR5.15 HDR5.13
  Bottom Layer w0.305: U13.9 40.63,12.12 41.01,12.51 v2(41.35,12.51) 41.85,12.51 42.03,12.33 U13.11 ; C26.2 35.89,15.05 38.53,12.4 U13.6 ; v2(39.7,15.68) 39.7,16.8 D3.1
  Bottom Layer w0.508: R15.2 50.39,16.42 49.98,16.82 48.71,16.82 ; 45.28,16.82 48.71,16.82 ; 45.28,16.82 41.22,16.82 ; 45.28,16.82 45.54,16.57 45.54,15.27 R13.1 ; 48.71,16.82 48.86,16.67 R14.2 ; R11.2 41.6,15.4 41.6,16.44 41.22,16.82 ; 41.22,16.82 D3.1 39.57,16.97 C27.2 37.52,17.14 C26.2 ; C49.2 C48.2 42.91,24.75 U16.4 U16.2
  Bottom Layer w0.762: C49.2 38.1,24.75 37.66,24.32 37.66,17
VCC_SR04_1: length 15.8
  Top Layer w0.508: H2.1 58.42,74.52 58.42,69.92 59.72,68.62 HDR1.15
VCC_SR04_2: length 25.7
  Top Layer w0.508: HDR3.1 87.74,47.55 v2(87.76,47.57)
  Bottom Layer w0.508: v2(87.76,47.57) 90.3,47.57 93.22,50.49 93.22,61.79 H3.1
VCC_SR04_3: length 58.9
  Top Layer w0.508: v2(6.48,49.47) 6.48,46.8 v2(5.46,45.79) ; v2(5.84,38.04) 5.46,38.42 v2(5.46,43.25) ; v2(9.78,13.15) 9.76,13.13 HDR5.7
  Bottom Layer w0.508: v2(5.46,45.79) v2(5.46,43.25) ; v2(5.84,38.04) 5.84,17.09 v2(9.78,13.15) ; v2(6.48,49.47) 6.48,59.12 9.68,62.33 H4.1
(no net):
  vias: v1(4.87,77.75) v1(4.87,5.75) v1(94.82,5.44) v1(94.87,77.75)
A02: length 45.5
  Top Layer w0.508: 18.2,73.21 18.2,74.28 21.21,77.28 24.26,77.28 28.73,81.76 41.38,81.76 42.42,80.71 42.42,77.79 45.85,74.36 45.85,69.92 46.99,68.78 46.99,65.99 HDR1.5
A_Y: length 6.2
  Top Layer w0.305: 右电机.1 7.24,21.48 7.24,16.55 7.22,16.53
A_Z: length 32.2
  Top Layer w0.508: HDR3.14 71.06,44.08 72.26,45.28 72.26,49.47 75.57,52.77 83.14,52.77 左电机.1
AD0: length 22
  Top Layer w0.305: HDR3.19 62.62,47.55 v2(61.72,48.46) ; U10.9 49.42,42.85 v2(49.28,42.99)
  Bottom Layer w0.305: v2(49.28,42.99) 49.28,46.68 52.38,49.78 60.4,49.78 v2(61.72,48.46)
AIN1: length 42.4
  Top Layer w0.305: v2(17.4,78.55) 17.55,78.71 U9.21
  Top Layer w0.508: v2(52.07,73.98) 52.07,71.59 HDR1.10
  Bottom Layer w0.305: v2(17.4,78.55) 17.53,78.55 19.43,80.46 30.73,80.46 32.39,78.81 44.2,78.81 45.97,77.03 49.02,77.03 v2(52.07,73.98)
AIN2: length 52
  Top Layer w0.305: v2(16.51,78.55) 16.9,78.95 U9.22
  Top Layer w0.508: v2(54.74,74.36) 54.74,71.65 HDR1.12
  Bottom Layer w0.305: v2(54.74,74.36) 54.86,74.49 54.86,80.33 54.1,81.09 43.05,81.09 41.27,79.32 32.89,79.32 31.11,81.09 19.05,81.09 v2(16.51,78.55)
AO1: length 50.5
  Top Layer w0.508: HDR1.7 49.66,66.05 49.66,68.52 48.39,69.79 48.39,73.09 43.18,78.3 43.18,81.22 42.04,82.36 27.56,82.36 23.24,78.05 19.3,78.05 15.6,74.34 U9.1
B02: length 37.9
  Top Layer w0.508: HDR1.3 44.48,68.62 43.18,69.92 43.18,73.73 42.29,74.62 39.24,74.62 38.61,75.25 38.61,77.54 37.21,78.94 27.43,78.94 24.77,76.27 21.97,76.27 20.15,74.45 U9.8
B_Y: length 9.3
  Top Layer w0.305: 右电机.2 4.68,20.92 4.68,16.53
B_Z: length 28.5
  Top Layer w0.508: HDR3.12 73.66,42.01 73.66,44.39 74.8,45.53 74.8,48.96 77.6,51.76 84.12,51.76 左电机.2
BIN1: length 36.8
  Top Layer w0.305: v2(19.94,78.81) 20.15,79.02 U9.17
  Top Layer w0.508: HDR1.8 49.66,71.65 v2(49.66,73.86)
  Bottom Layer w0.305: v2(19.94,78.81) 21.18,80.05 30.13,80.05 31.88,78.3 43.31,78.3 45.34,76.27 47.24,76.27 v2(49.66,73.86)
BIN2: length 32.5
  Top Layer w0.305: U9.16 20.8,78.83 v2(20.83,78.81)
  Top Layer w0.508: HDR1.6 47.02,73.44 v2(46.99,73.47)
  Bottom Layer w0.305: v2(46.99,73.47) 42.67,77.79 31.5,77.79 29.64,79.65 21.67,79.65 v2(20.83,78.81)
BO1: length 30.9
  Top Layer w0.508: U9.12 22.75,74.38 24,75.63 25.53,75.63 27.94,78.05 36.7,78.05 37.97,76.78 37.97,73.6 40.89,70.68 40.89,69.41 41.91,68.39 41.91,65.99 HDR1.1
BOOT0: length 29.9
  Top Layer w0.305: U2.60 39.4,56.81 40.77,55.44 40.77,47.44 42.8,45.41 42.8,35.12 41.78,34.1 R5.1
BOOT1: length 23.2
  Top Layer w0.305: v2(36.83,45.66) 38.35,45.66 39.89,44.13 R6.2 ; U2.28 v2(27.17,53.31)
  Bottom Layer w0.305: v2(27.17,53.31) 32.67,53.31 36.83,49.15 v2(36.83,45.66)
ECHO_1: length 15.8
  Top Layer w0.508: HDR1.11 54.64,68.87 53.47,70.05 53.47,74.39 H2.3
ECHO_2: length 24
  Top Layer w0.508: HDR3.5 81.49,47.82 v2(82.55,47.82)
  Bottom Layer w0.508: v2(82.55,47.82) 87.63,52.9 87.63,61.28 H3.3
ECHO_3: length 57.9
  Top Layer w0.508: HDR5.3 4.68,13.13 v2(4.7,13.15)
  Bottom Layer w0.508: v2(4.7,13.15) 1.52,16.32 1.52,51.88 4.6,54.96 H4.3
HC05_RX: length 3.8
  Top Layer w0.508: U17.2 64.88,71.63 HDR1.20
HC05_TX: length 9.1
  Top Layer w0.508: U17.1 67.31,74.36 63.25,74.36 62.26,73.38 HDR1.18
INT: length 29.8
  Top Layer w0.305: U10.12 50.68,41.35 49.78,40.45 v2(49.78,40.2) ; HDR3.17 65.55,47.55 v2(64.77,48.33)
  Bottom Layer w0.305: v2(64.77,48.33) 62.86,50.23 51.44,50.23 48.01,46.8 48.01,41.98 v2(49.78,40.2)
M+_Y: length 18.6
  Top Layer w0.508: 右电机.6 11.81,28.69 11.81,21.28 14.84,18.25 14.84,16.53
M+_Z: length 14.6
  Top Layer w0.508: 左电机.6 91.14,51.2 89.79,49.85 89.79,46.68 87.63,44.52 84.45,44.52 83.76,43.83 HDR3.4
M-_Y: length 15.6
  Top Layer w0.508: 12.3,16.53 12.3,18.63 10.8,20.13 10.8,27.71 右电机.5
M-_Z: length 18.1
  Top Layer w0.508: HDR3.6 81.22,44.08 82.55,45.41 87,45.41 88.77,47.19 88.77,50.41 左电机.5
NRST: length 29.6
  Top Layer w0.305: v2(33.91,70.68) 33.91,71.82 U5.1 33.97,71.88 C11.2 33.62,73.95 KEY1.2 ; U2.7 30.72,59.52 30.86,59.38 v2(31.5,59.38)
  Bottom Layer w0.305: v2(31.5,59.38) 33.91,59.38 35.69,61.16 38.1,61.16 39.62,62.68 39.62,68.52 38.1,70.05 34.54,70.05 v2(33.91,70.68)
OSC32_IN: length 9
  Top Layer w0.305: 37.97,66.24 37.97,66.08 C8.2 36.09,64.2 33.66,64.2 32.72,63.27 U2.3
OSC32_OUT: length 8.9
  Top Layer w0.305: 34.69,66.5 34.66,66.5 ; 34.69,66.5 32.22,64.03 U2.4 ; 34.69,66.5 36.2,68.01
OSC_IN: length 12.1
  Top Layer w0.305: U2.5 31.72,63.27 R1.2 28.44,66.55 28.44,67.9 ; 28.44,67.9 26.5,69.84 X3.1 ; 28.44,67.9 C10.1
OSC_OUT: length 12.1
  Top Layer w0.305: U2.6 31.24,60.83 31.24,62.81 29.23,64.81 R1.1 27.78,65.08 25.25,65.08 X3.2
PA0: length 40
  Top Layer w0.305: v2(28.7,57.22) 27.22,58.7 U2.14
  Top Layer w0.508: v2(58.93,59.25) 59.72,60.05 HDR2.16
  Bottom Layer w0.305: v2(58.93,59.25) 58.17,58.49 53.85,58.49 53.42,58.06 51.51,58.06 50.06,56.61 48.87,56.61 47.88,57.6 36.96,57.6 34.42,55.06 33.53,55.06 32.39,56.2 29.85,56.2 28.83,57.22 v2(28.7,57.22)
PA1: length 44.3
  Top Layer w0.305: U2.15 26.72,57.93 v2(28.07,56.58)
  Top Layer w0.508: v2(61.09,59.38) 62.26,60.55 HDR2.18
  Bottom Layer w0.305: v2(28.07,56.58) 29.08,55.57 31.88,55.57 33.53,53.92 34.16,53.92 37.34,57.09 47.75,57.09 48.95,55.9 50.24,55.9 51.69,57.35 53.98,57.35 54.48,57.85 58.93,57.85 60.45,59.38 v2(61.09,59.38)
PA2: length 48.6
  Top Layer w0.305: U2.16 26.22,57.29 v2(27.43,56.08)
  Top Layer w0.508: HDR2.20 64.8,59.92 v2(64.01,59.12)
  Bottom Layer w0.305: v2(27.43,56.08) 28.58,54.93 31.62,54.93 33.33,53.23 34.62,53.23 37.97,56.58 47.12,56.58 48.26,55.44 50.8,55.44 51.94,56.58 54.1,56.58 54.74,57.22 60.2,57.22 62.1,59.12 v2(64.01,59.12)
PA3: length 44.7
  Top Layer w0.305: U2.17 22.99,58.81 22.23,59.57 v2(22.23,59.63) ; HDR6.19 13.44,33.58 v2(13.46,33.6)
  Bottom Layer w0.305: v2(13.46,33.6) 7.87,39.18 7.87,54.68 12.83,59.63 v2(22.23,59.63)
PA4: length 44.2
  Top Layer w0.305: U2.20 21.94,57.31 21.72,57.09 v2(21.34,57.09) ; v2(16,33.98) 15.98,33.96 HDR6.17
  Bottom Layer w0.305: v2(21.34,57.09) 11.68,57.09 8.38,53.79 8.38,39.95 13.72,34.61 15.37,34.61 v2(16,33.98)
PA5: length 44.5
  Top Layer w0.305: HDR6.15 18.42,31.16 v2(18.42,33.85) ; U2.21 22.2,56.81 21.72,56.33 v2(20.95,56.33)
  Bottom Layer w0.305: v2(18.42,33.85) 17.02,35.25 14.1,35.25 9.02,40.33 9.02,53.15 12.19,56.33 v2(20.95,56.33)
PA6: length 44.9
  Top Layer w0.305: HDR6.13 21.06,33.7 v2(21.08,33.72) ; U2.22 22.59,56.31 21.97,55.69 v2(21.46,55.69)
  Bottom Layer w0.305: v2(21.46,55.69) 12.83,55.69 9.65,52.52 9.65,40.84 14.61,35.88 18.92,35.88 v2(21.08,33.72)
PA7: length 45.5
  Top Layer w0.305: HDR6.11 23.62,31.07 v2(23.62,33.6) ; v2(20.57,55.06) 22.1,55.06 22.85,55.81 U2.23
  Bottom Layer w0.305: v2(20.57,55.06) 13.46,55.06 10.16,51.76 10.16,41.09 14.86,36.39 20.83,36.39 v2(23.62,33.6)
PA8: length 34.6
  Top Layer w0.305: HDR6.12 23.62,25.47 v2(24.89,25.47) ; v2(35.56,46.17) 35.56,43.56 33.72,41.72 32.51,41.72 24.89,34.1 v2(24.89,33.52) ; U2.41 30.22,47.95 v2(30.99,47.19)
  Bottom Layer w0.305: v2(30.99,47.19) 33.27,47.19 34.29,46.17 v2(35.56,46.17) ; v2(24.89,25.47) v2(24.89,33.52)
PA9: length 33.6
  Top Layer w0.305: v2(27.43,25.47) 26.16,25.47 HDR6.10 ; v2(35.05,46.8) 35.92,46.8 36.17,46.55 36.17,43.6 27.43,34.86 v2(27.43,33.55) ; U2.42 30.72,48.16 31.06,47.82 v2(31.5,47.82)
  Bottom Layer w0.305: v2(35.05,46.8) 34.8,46.8 33.4,48.2 31.88,48.2 v2(31.5,47.82) ; v2(27.43,25.47) v2(27.43,33.55)
PA10: length 38.6
  Top Layer w0.305: v2(38.23,46.3) 36.83,47.69 v2(34.92,47.69) ; v2(30.1,51.5) 31.22,50.38 U2.43 ; HDR6.8 28.8,25.34 v2(29.85,25.34) ; v2(29.85,32.02) 29.85,36.39 v2(35.05,41.6)
  Bottom Layer w0.305: v2(38.23,46.3) 38.23,44.77 v2(35.05,41.6) ; v2(34.92,47.69) 33.91,48.71 32.89,48.71 v2(30.1,51.5) ; v2(29.85,25.34) v2(29.85,32.02)
PA11: length 39.2
  Top Layer w0.305: v2(30.99,51.88) 31.72,51.15 U2.44 ; v2(35.05,25.34) 33.88,25.34 HDR6.4 ; v2(35.05,29.91) 35.05,33.22 37.34,35.5 37.34,40.33 37.97,40.96 v2(37.97,42.49) ; v2(35.43,49.34) 37.21,49.34 37.97,48.58 38.4,48.58 39.55,47.44 v2(39.62,47.44)
  Bottom Layer w0.305: v2(35.43,49.34) 35.43,49.47 32.51,52.39 31.5,52.39 v2(30.99,51.88) ; v2(37.97,42.49) 39.62,44.14 v2(39.62,47.44) ; v2(35.05,25.34) v2(35.05,29.91)
PA12: length 36.8
  Top Layer w0.305: v2(38.61,47.19) 37.21,48.58 v2(35.18,48.58) ; v2(32.26,51.63) 32.22,51.59 U2.45 ; v2(36.58,42.11) 32.13,37.66 32.13,33.85 32.39,33.6 v2(32.39,31.14) ; v2(32.39,25.34) 31.33,25.34 HDR6.6
  Bottom Layer w0.305: v2(35.18,48.58) 32.26,51.5 v2(32.26,51.63) ; v2(36.58,42.11) 39.07,44.59 39.07,46.73 v2(38.61,47.19) ; v2(32.39,25.34) v2(32.39,31.14)
PA15: length 26.9
  Top Layer w0.305: U2.50 37.41,51.81 38.23,51 v2(38.23,49.6) ; HDR2.4 44.48,59.5 44.86,59.12 46.99,59.12 48.51,57.6 48.51,53.08 48.21,52.77 45.08,52.77 v2(42.42,50.11)
  Bottom Layer w0.305: v2(42.42,50.11) 41.91,49.6 v2(38.23,49.6)
PB0: length 49.7
  Top Layer w0.305: v2(31.24,33.85) 31.24,31.07 HDR6.5 ; v2(26.8,54.81) 26.3,54.31 U2.26
  Bottom Layer w0.305: v2(31.24,33.85) 26.04,39.06 17.02,39.06 12.7,43.38 12.7,48.07 15.49,50.87 21.21,50.87 25.15,54.81 v2(26.8,54.81)
PB1: length 50.9
  Top Layer w0.305: v2(27.56,54.04) 27.05,54.04 26.82,53.81 U2.27 ; v2(33.02,33.22) 33.76,32.47 HDR6.3
  Bottom Layer w0.305: v2(33.02,33.22) 33.02,33.34 26.8,39.57 17.28,39.57 13.21,43.63 13.21,47.31 16.13,50.23 22.1,50.23 25.91,54.04 v2(27.56,54.04)
PB3: length 24
  Top Layer w0.305: U2.55 35.73,54.3 v2(39.37,54.3)
  Top Layer w0.508: HDR2.13 57.18,53.82 v2(56.39,53.03)
  Bottom Layer w0.305: v2(56.39,53.03) 40.64,53.03 v2(39.37,54.3)
PB4: length 21
  Top Layer w0.305: U2.56 38.48,54.81 v2(38.61,54.93)
  Top Layer w0.508: v2(53.21,53.66) 54.1,53.66 54.64,54.2 HDR2.11
  Bottom Layer w0.305: v2(53.21,53.66) 41.53,53.66 40.26,54.93 v2(38.61,54.93)
PB5: length 17.7
  Top Layer w0.305: U2.57 37.72,55.31 v2(37.85,55.44)
  Top Layer w0.508: v2(50.8,54.68) 51.58,55.45 HDR2.9
  Bottom Layer w0.305: v2(37.85,55.44) 38.23,55.82 38.23,55.87 38.53,56.18 40.67,56.18 41.66,55.19 45.97,55.19 46.48,54.68 v2(50.8,54.68)
PB6: length 20
  Top Layer w0.305: U2.58 34.17,55.81 v2(34.16,55.82) ; HDR2.7 49.56,56.93 v2(49.28,57.22)
  Bottom Layer w0.305: v2(34.16,55.82) 36.58,58.23 48.26,58.23 v2(49.28,57.22)
PB7: length 12.5
  Top Layer w0.305: U2.59 38.76,56.31 v2(39.5,55.57)
  Top Layer w0.508: HDR2.5 45.99,54.42 v2(45.72,54.42)
  Bottom Layer w0.305: v2(39.5,55.57) 40.51,55.57 41.66,54.42 v2(45.72,54.42)
PB8: length 7.9
  Top Layer w0.305: HDR2.1 42.04,55.55 42.04,56.84 41.57,57.31 U2.61
PB9: length 10.8
  Top Layer w0.305: HDR2.3 44.48,57.19 43.86,57.81 U2.62
PB10: length 54
  Top Layer w0.305: U2.29 23.2,52.81 v2(22.61,53.41) ; v2(36.07,29.15) 36.3,29.39 HDR6.1
  Bottom Layer w0.305: v2(22.61,53.41) 22.23,53.79 21.34,53.79 20.7,53.15 15.49,53.15 11.68,49.34 11.68,42.49 16.26,37.91 25.12,37.91 31.22,31.82 34.16,31.82 36.07,29.91 v2(36.07,29.15)
PB11: length 56
  Top Layer w0.305: v2(21.72,53.15) 21.72,53.03 22.44,52.31 U2.30 ; v2(37.47,26.1) 36.95,26.1 HDR6.2
  Bottom Layer w0.305: v2(21.72,53.15) 20.95,52.39 15.88,52.39 12.19,48.71 12.19,42.87 16.64,38.42 25.4,38.42 31.37,32.45 34.67,32.45 37.64,29.48 37.64,26.28 v2(37.47,26.1)
PB12: length 70.9
  Top Layer w0.305: v2(38.1,30.42) 38.1,29.96 36.65,28.52 14.48,28.52 13.46,27.5 13.46,25.47 HDR6.20 ; v2(24.13,47.95) 25.91,47.95 26.22,48.26 U2.33
  Bottom Layer w0.305: v2(24.13,47.95) 18.54,47.95 16.89,46.3 16.89,41.09 17.91,40.07 27.18,40.07 34.16,33.09 36.7,33.09 38.1,31.69 v2(38.1,30.42)
PB13: length 68.9
  Top Layer w0.305: HDR6.18 15.98,27.74 16.26,28.01 37.34,28.01 38.86,29.53 v2(38.86,30.42) ; U2.34 26.72,48.13 25.91,47.31 v2(24.89,47.31)
  Bottom Layer w0.305: v2(24.89,47.31) 18.8,47.31 17.65,46.17 17.65,41.6 18.67,40.58 27.43,40.58 34.42,33.6 36.83,33.6 38.86,31.56 v2(38.86,30.42)
PB14: length 67.6
  Top Layer w0.305: v2(39.75,30.42) 39.75,26.23 36.7,23.18 21.72,23.18 21.06,23.84 HDR6.14 ; U2.35 27.22,47.86 26.04,46.68 v2(25.4,46.68)
  Bottom Layer w0.305: v2(25.4,46.68) 19.56,46.68 18.29,45.41 18.29,42.23 19.43,41.09 27.69,41.09 34.54,34.23 36.96,34.23 39.75,31.44 v2(39.75,30.42)
PB15: length 57.7
  Top Layer w0.305: v2(26.04,46.04) 26.42,46.04 27.72,47.35 U2.36 ; v2(40.64,30.42) 40.64,26.48 36.7,22.55 19.56,22.55 18.52,23.58 HDR6.16
  Bottom Layer w0.305: v2(40.64,30.42) 40.64,31.44 37.34,34.74 34.67,34.74 27.81,41.6 27.31,41.6 26.04,42.87 v2(26.04,46.04)
PC0: length 22.1
  Top Layer w0.305: v2(32.13,58.74) 30.71,58.74 30.22,59.23 U2.8
  Top Layer w0.508: v2(48.51,61.03) 49.54,61.03 HDR2.8
  Bottom Layer w0.305: v2(48.51,61.03) 48.01,60.52 35.69,60.52 33.91,58.74 v2(32.13,58.74)
PC1: length 25.7
  Top Layer w0.305: U2.9 29.72,59.12 v2(30.73,58.11)
  Top Layer w0.508: v2(50.93,61.03) 52.08,61.03 HDR2.10
  Bottom Layer w0.305: v2(50.93,61.03) 49.78,59.89 35.69,59.89 33.91,58.11 v2(30.73,58.11)
PC2: length 29.7
  Top Layer w0.305: v2(30.1,57.6) 29.22,58.48 U2.10
  Top Layer w0.508: HDR2.12 53.73,60.14 v2(53.47,60.14)
  Bottom Layer w0.305: v2(30.1,57.6) 30.23,57.47 33.91,57.47 35.81,59.38 52.7,59.38 v2(53.47,60.14)
PC3: length 33.8
  Top Layer w0.305: U2.11 28.72,58.64 v2(28.45,58.36)
  Top Layer w0.508: v2(56.13,59.76) 57.18,60.81 HDR2.14
  Bottom Layer w0.305: v2(56.13,59.76) 55.5,59.12 53.47,59.12 53.09,58.74 36.07,58.74 34.16,56.84 29.97,56.84 v2(28.45,58.36)
PC4: length 45.9
  Top Layer w0.305: v2(26.16,33.47) 26.16,31.07 HDR6.9 ; U2.24 22.98,55.31 22.1,54.42 v2(21.21,54.42)
  Bottom Layer w0.305: v2(21.21,54.42) 14.22,54.42 10.67,50.87 10.67,41.6 15.37,36.9 22.73,36.9 v2(26.16,33.47)
PC5: length 46.4
  Top Layer w0.305: v2(28.7,33.47) 28.68,33.45 HDR6.7 ; U2.25 23.12,54.81 22.1,53.79 v2(20.32,53.79)
  Bottom Layer w0.305: v2(28.7,33.47) 27.31,34.87 25.91,34.87 23.39,37.38 15.9,37.38 11.18,42.11 11.18,49.98 14.99,53.79 v2(20.32,53.79)
PC6: length 60.7
  Top Layer w0.305: v2(41.53,30.42) 41.53,26.36 36.96,21.79 19.69,21.79 17.38,19.48 17.38,16.53 ; U2.37 28.22,46.71 v2(27.56,46.04)
  Bottom Layer w0.305: v2(41.53,30.42) 41.53,31.44 37.72,35.25 34.8,35.25 27.56,42.49 v2(27.56,46.04)
PC7: length 59.6
  Top Layer w0.305: U2.38 28.72,46.15 31.37,43.5 v2(31.37,42.61) ; v2(42.42,30.42) 42.93,29.91 42.93,26.23 37.85,21.15 21.46,21.15 19.92,19.61 19.92,16.53
  Bottom Layer w0.305: v2(31.37,42.61) 31.37,39.44 34.8,36.01 37.85,36.01 42.42,31.44 v2(42.42,30.42)
PC8: length 58.5
  Top Layer w0.305: 22.46,16.53 22.48,16.55 22.48,18.74 24.13,20.39 37.97,20.39 43.56,25.98 43.56,30.17 v2(43.31,30.42) ; v2(32.64,43.12) 29.22,46.54 U2.39
  Bottom Layer w0.305: v2(32.64,43.12) 32.64,40.07 34.16,38.55 39.12,38.55 39.93,37.74 39.93,34.69 43.31,31.31 v2(43.31,30.42)
PC9: length 58.1
  Top Layer w0.305: U2.40 29.72,46.93 v2(33.53,43.12) ; v2(44.2,30.42) 44.2,25.72 38.23,19.75 25.78,19.75 25,18.97 25,16.53
  Bottom Layer w0.305: v2(44.2,30.42) 44.2,36.31 42.09,38.42 40.51,38.42 40.01,38.93 40.01,40.2 39.24,40.96 33.91,40.96 33.53,41.34 v2(33.53,43.12)
PC10: length 27.1
  Top Layer w0.305: v2(41.4,50.23) 44.58,53.41 48.01,53.41 48.01,57.22 46.61,58.62 43.31,58.62 41.94,59.98 HDR2.2 ; v2(38.99,50.23) 38.99,51.12 37.8,52.31 U2.51
  Bottom Layer w0.305: v2(41.4,50.23) v2(38.99,50.23)
PC11: length 33.8
  Top Layer w0.305: v2(39.37,51.63) 38.19,52.81 U2.52
  Top Layer w0.508: v2(63.63,50.87) 64.8,52.04 HDR2.19
  Bottom Layer w0.305: v2(63.63,50.87) 40.13,50.87 v2(39.37,51.63)
PC12: length 30
  Top Layer w0.305: U2.53 38.58,53.31 v2(39.5,52.39)
  Top Layer w0.508: v2(60.45,51.63) 62.26,53.44 HDR2.17
  Bottom Layer w0.305: v2(60.45,51.63) 40.26,51.63 v2(39.5,52.39)
PC13: length 18.3
  Top Layer w0.305: v2(39.24,61.41) 36.58,61.41 35.05,62.93 33.91,62.93 33.22,62.25 U2.2
  Top Layer w0.508: HDR2.6 47.02,62.39 v2(46.48,62.93)
  Bottom Layer w0.305: v2(39.24,61.41) 40.77,62.93 v2(46.48,62.93)
PD2: length 26.9
  Top Layer w0.305: U2.54 38.97,53.81 v2(39.37,53.41)
  Top Layer w0.508: HDR2.15 59.72,53.7 v2(58.42,52.39)
  Bottom Layer w0.305: v2(39.37,53.41) 40.39,52.39 v2(58.42,52.39)
PWMA: length 53
  Top Layer w0.305: v2(15.75,78.68) 16.25,79.19 U9.23
  Top Layer w0.508: v2(57.15,74.49) 57.18,74.46 HDR1.14
  Bottom Layer w0.305: v2(57.15,74.49) 56.01,75.63 56.01,79.95 54.23,81.73 18.8,81.73 v2(15.75,78.68)
PWMB: length 29.1
  Top Layer w0.305: v2(21.97,78.81) 21.45,79.33 U9.15
  Top Layer w0.508: HDR1.4 44.48,73.7 v2(44.45,73.73)
  Bottom Layer w0.305: v2(21.97,78.81) 29.46,78.81 31.01,77.26 41.94,77.26 44.45,74.74 v2(44.45,73.73)
SCL: length 14.5
  Top Layer w0.305: v2(65.15,39.82) 65.98,40.65 HDR3.18 ; U10.23 57.38,43.35 R17.1 57.45,42.31 v2(57.91,41.85)
  Bottom Layer w0.305: v2(65.15,39.82) 59.94,39.82 v2(57.91,41.85)
SCL_OLED: length 34.5
  Top Layer w0.508: HDR5.19 25,7.58 26.67,5.91 46.1,5.91 46.86,6.67 v2(46.86,7.44)
  Bottom Layer w0.305: v2(46.86,7.44) 46.86,9.86 U13.18 46.93,12.08 47.61,12.76 48.31,12.76 48.71,13.16 48.71,13.59 R14.1
SDA: length 17.4
  Top Layer w0.305: HDR3.16 68.52,44.07 v2(68.45,44.14) ; U10.24 55.47,43.85 56.55,44.94 R16.1 58.81,46.3 v2(59.05,46.3)
  Bottom Layer w0.305: v2(68.45,44.14) 62.48,44.14 60.33,46.3 v2(59.05,46.3)
SDA_OLED: length 39.8
  Top Layer w0.508: v2(47.75,7.44) 47.75,6.29 46.61,5.15 24.89,5.15 22.46,7.58 HDR5.17
  Bottom Layer w0.305: R15.1 50.39,13.04 50.11,12.76 48.97,12.76 48.33,12.12 U13.20 U13.19 47.75,9.8 v2(47.75,7.44)
STATE: length 28.5
  Top Layer w0.508: R33.1 85.84,71.2 85.22,71.82 80.26,71.82 76.83,68.39 62.86,68.39 62.26,67.79 HDR1.17
SWCLK: length 42.8
  Top Layer w0.305: U2.49 36.9,51.31 37.47,50.74 v2(37.47,49.98) ; v2(16.19,43.88) v2(20.8,43.88) ; v2(24.38,43.76) 29.11,43.76 v2(29.24,43.88) ; U6.3 3.94,43.88 v2(13.82,43.88)
  Bottom Layer w0.305: v2(20.8,43.88) 24.26,43.88 v2(24.38,43.76) ; v2(29.24,43.88) 36.2,43.88 37.47,45.15 v2(37.47,49.98) ; v2(16.19,43.88) v2(13.82,43.88)
SWDIO: length 32.9
  Top Layer w0.305: v2(13.82,44.65) 4.19,44.65 U6.2 ; v2(31.5,46.3) 32.72,47.52 U2.46 ; v2(28.45,44.65) v2(24.32,44.65) ; v2(16.19,44.65) v2(20.78,44.65)
  Bottom Layer w0.305: v2(28.45,44.65) 29.85,44.65 v2(31.5,46.3) ; v2(13.82,44.65) v2(16.19,44.65) ; v2(20.78,44.65) v2(24.32,44.65)
TB_5V: length 38.8
  Top Layer w0.508: U9.19 18.85,79.62 18.16,78.93 ; v2(41.91,73.73) 41.91,71.59 HDR1.2 ; 18.16,78.93 18.16,78.05 17.27,77.16 v2(16.53,77.16) 14.79,77.16 13.34,75.7 ; 18.16,78.93 18.16,80.3 18.2,80.34
  Bottom Layer w0.508: v2(41.91,73.73) 41.15,74.49 32.13,74.49 29.46,77.16 v2(16.53,77.16)
TB_12V: length 69.3
  Top Layer w0.508: 15.37,81.73 v2(17.37,81.73) 22.35,81.73 ; 15.37,81.73 14.33,81.73 13.46,80.86 C22.1 11.67,80.14 C23.1 ; 15.37,81.73 15.6,81.49 U9.24 ; U9.14 22.1,81.06 22.35,81.31 22.35,81.73 ; 22.35,81.73 22.75,81.33 U9.13 ; HDR1.16 59.82,71.65 v2(59.82,74.36)
  Bottom Layer w0.508: v2(59.82,74.36) 59.69,74.49 59.18,74.49 57.15,76.52 57.15,79.95 54.74,82.36 18,82.36 v2(17.37,81.73)
TRIG_1: length 15.9
  Top Layer w0.508: HDR1.13 57.28,66.05 57.28,68.78 55.88,70.17 55.88,74.52 H2.2
TRIG_2: length 24.5
  Top Layer w0.508: HDR3.3 83.9,47.69 v2(85.09,47.69)
  Bottom Layer w0.508: v2(85.09,47.69) 88.65,51.25 88.65,60.39 94.51,66.25 H3.2
TRIG_3: length 57.4
  Top Layer w0.508: HDR5.5 7.22,13.13 v2(7.24,13.15) ; v2(4.83,46.42) 5.33,46.93 v2(5.33,49.47) ; v2(4.7,38.04) v2(4.7,42.87)
  Bottom Layer w0.508: v2(7.24,13.15) 4.7,15.69 v2(4.7,38.04) ; v2(4.83,46.42) 4.7,46.3 v2(4.7,42.87) ; v2(5.33,49.47) 5.33,59.63 7.14,61.44 H4.2
XCL: length 28.3
  Top Layer w0.305: U10.7 50.45,43.85 50.01,44.29 50.01,46.78 53.34,50.11 70.1,50.11 71.12,49.09 71.12,47.61 HDR3.13
XDA: length 22.1
  Top Layer w0.305: U10.6 51.89,47.52 53.98,49.6 67.95,49.6 68.52,49.02 HDR3.15
$1N3226: length 3.1
  Top Layer w0.508: H1.3 38.62,37.14 R5.2
$1N3227: length 4.3
  Top Layer w0.305: R6.1 41.39,41.84 40.77,41.22 40.13,41.22 H1.4
$1N3962: length 3
  Top Layer w0.508: U1.1 66.61,18.23 C13.1
$1N3965: length 14.4
  Top Layer w0.508: U1.3 66.86,15.69 C13.2
  Top Layer w0.762: L3.2 68.48,20.62 68.96,20.13 69.98,20.13 71.5,18.61 71.5,16.45 70.74,15.69 U1.3
$1N4478: length 1.8
  Top Layer w0.508: U1.7 75.94,16.96 R9.1
$1N13670: length 10.6
  Bottom Layer w0.305: U13.2 35.73,12.02 35,12.76 31.19,12.76 29.24,14.7 C24.2
$1N13682: length 10.2
  Bottom Layer w0.305: U13.3 36.43,12.21 35.25,13.39 31.69,13.39 30.64,14.45 C24.1
$1N13715: length 9
  Bottom Layer w0.305: U13.4 37.13,12.27 35.5,13.9 33.15,13.9 32.54,14.51 C25.2
$1N13718: length 8.1
  Bottom Layer w0.305: C25.1 33.94,14.83 34.36,14.41 35.76,14.41 37.83,12.34 U13.5
$1N13876: length 6.8
  Bottom Layer w0.305: U13.8 39.93,12.08 39.5,12.51 39.06,12.51 37.69,13.88 C27.1
$1N14383: length 4.1
  Bottom Layer w0.305: U13.26 52.53,12.24 52.01,12.76 52.01,13.64 R10.2
$1N14540: length 4.1
  Bottom Layer w0.305: C28.1 53.69,12.66 53.23,12.2 U13.27
$1N14626: length 6.3
  Bottom Layer w0.305: U13.28 53.93,12.26 C30.2 C29.1
$1N15088: length 8.1
  Bottom Layer w0.305: U13.14 44.13,13.2 C31.1 43.48,13.74 R11.1 40.02,13.74 D3.2
$1N15283: length 5.8
  Bottom Layer w0.305: U13.15 44.83,12.69 45.16,13.01 45.16,13.34 R13.2 R12.1
$1N23291: length 3.4
  Top Layer w0.305: U10.10 48.08,42.35 C34.2
$1N23685: length 1.7
  Top Layer w0.305: U10.20 56.4,41.85 C36.2
$1N26246: length 2.4
  Top Layer w0.305: R18.2 46.88,39.46 LED1.2
$1N26808: length 2.6
  Top Layer w0.508: U15.1 85.99,18.42 C42.1
$1N26809: length 13.6
  Top Layer w0.508: U15.3 85.99,15.88 C42.2
  Top Layer w0.762: U15.3 89.48,15.88 90.37,16.77 90.37,18.55 87.6,21.32 L4.2
$1N26814: length 2.1
  Top Layer w0.762: R21.1 94.55,17.15 U15.7
$1N32704: length 2.7
  Top Layer w0.305: R22.2 15.4,58.23 LED4.2
$1N32715: length 2.6
  Top Layer w0.305: R23.2 15.29,60.29 LED5.2
$1N33702: length 11.9
  Top Layer w0.762: LED7.2 85.97,59.87 v3(84.58,58.49)
  Bottom Layer w0.762: v3(84.58,58.49) 82.17,58.49 80.02,56.34 R30.2
$1N34229: length 23.2
  Top Layer w0.762: R31.2 85.97,76.79 84.07,78.68 67.95,78.68 KEY2.3
$1N34236: length 4
  Top Layer w0.762: R31.1 R32.2 84.34,73.09 U17.34
$1N34289: length 2.1
  Top Layer w0.762: R33.2 84.29,70.09 U17.32
$1N34387: length 3
  Top Layer w0.762: U17.31 82.3,67.89 82.93,67.25 R34.2
$1N34392: length 3
  Top Layer w0.762: LED6.2 85.97,67.13 R34.1
$1N34524: length 2
  Top Layer w0.305: LED2.2 88.09,7.89 R36.1
$1N34558: length 2
  Top Layer w0.305: R35.1 67.18,8.08 LED3.2

## Copper pours and planes (outline as drawn; the poured copper is in the pictures)
5V_1 on Top Layer: 87.19,12.07 95.96,12.07 95.96,9.02 87.19,9.02
5V_2 on Top Layer: 68.2,11.71 77.04,11.71 77.04,9.09 68.2,9.09
5V_2 on Top Layer: 67.82,33.34 74.3,33.34 74.3,30.42 67.82,30.42
5V_BLUE on Bottom Layer: 73.92,62.57 75.71,62.57 75.71,56.18 73.92,56.18
5V_MPU on Bottom Layer: 54.14,49.31 55.84,49.31 55.84,42.52 54.14,42.52
5V_OLED on Bottom Layer: 47.95,22.67 54.55,22.67 54.55,21.25 47.95,21.25
5V_STM on Top Layer: 12.25,38.42 19.05,38.42 19.05,36.79 12.25,36.79
GND on Top Layer: 20.57,73.98 21.72,73.98 21.72,72.59 20.57,72.59
GND on Top Layer: 8.76,75.72 14.35,75.72 14.35,73.73 8.76,73.73
GND on Top Layer: 86.55,15.12 91.09,15.12 91.09,12.33 86.55,12.33
GND on Top Layer: -4.56,88.45 105.05,88.45 105.05,-8.2 -4.56,-8.2
GND on Top Layer: 67.69,14.93 72.22,14.93 72.22,12.13 67.69,12.13
GND on Top Layer: 16.64,73.98 17.78,73.98 17.78,72.46 16.64,72.46
GND on Bottom Layer: -6.73,93.21 114.43,93.21 114.43,-12.58 -6.73,-12.58
GND on Bottom Layer: 73.88,71.95 74.9,71.95 74.9,68.72 73.88,68.72
GND on Bottom Layer: 72.39,59.38 73.63,59.38 73.63,56.14 72.39,56.14
VCC_3V3 on Top Layer: 22.48,42.11 29.19,42.11 29.19,40.06 22.48,40.06
VCC_3V3 on Top Layer: 16.08,41.32 25.15,41.32 25.15,38.8 16.08,38.8
VCC_3V3_BLUE on Bottom Layer: 75.08,72.2 79.35,72.2 79.35,59.76 75.08,59.76
VCC_3V3_MPU6050 on Bottom Layer: 51.82,45.28 53.76,45.28 53.76,32.45 51.82,32.45
VCC_OLED on Bottom Layer: 37.21,18.36 40.51,18.36 40.51,16.32 37.21,16.32
VCC_OLED on Bottom Layer: 36.82,25.46 39.95,25.46 39.95,23.17 36.82,23.17
VCC_OLED on Bottom Layer: 38.01,25.46 50.36,25.46 50.36,23.17 38.01,23.17
A02 on Top Layer: 18.01,73.98 19.02,73.98 19.02,72.55 18.01,72.55
AO1 on Top Layer: 15.37,73.98 16.38,73.98 16.38,72.46 15.37,72.46
B02 on Top Layer: 19.38,73.98 20.26,73.98 20.26,72.53 19.38,72.53
BO1 on Top Layer: 21.97,73.98 22.88,73.98 22.88,72.55 21.97,72.55
TB_5V on Top Layer: 18.03,81.09 19.02,81.09 19.02,79.57 18.03,79.57
TB_12V on Top Layer: 21.84,81.35 22.96,81.35 22.96,79.58 21.84,79.58
TB_12V on Top Layer: 8.68,80.59 14.18,80.59 14.18,77.8 8.68,77.8
$1N4279 on Top Layer: 73.41,14.93 77.09,14.93 77.09,12.26 73.41,12.26
$1N26811 on Top Layer: 92.15,15.25 96.1,15.25 96.1,12.57 92.15,12.57

Small or netless copper shapes (teardrops, artwork), in the pictures only: 433 on Top Layer, 301 on Bottom Layer

## Text on the board
Bottom Silkscreen Layer: 1 | 30
Top Silkscreen Layer: G_S3 | E_S3 | T_S3 | V_S3 | 5V-0LED | G | VCC_OLED_3V3 | SDA_OLED | SCL_OLED | 3_M | B_Y | A_Y | PA3 | PA4 | PA6 | PC4 | PC5 | PB0 | PB12 | PB13 | PB15 | PB14 | PA8 | PA9 | PA10 | PA12 | PA11 | PB11 | PB8 | PB6 | PB5 | PB4 | PB3 | 3.3_B | PD2 | 3.3_M | PC12 | 12v_2 | PC11 | ECH0_2 | TRIG_2 | VCC_SR04_2 | 5V_1 | 12V | M-_Y | M+_Y | PC6 | PC7 | PC8 | PC9 | PA5 | PA7 | PB1 | PB10 | PC10 | PA15 | PC13 | PC0 | PC1 | PC2 | PC3 | PA0 | PA1 | AD0 | PA2 | INT | XDA | 5V_2 | XCL | 12V_1 | PB9 | PB7 | G_S_2 | 5VM | SCL | SDA | AZ | BZ | 3.3MZ | M-_Z | M+_Z | GND | SWCLK | 3V3 | SWDIO | BO1 | B02 | GS1 | A02 | AO1 | VS1 | ST | 5VB | TBV | PWB | BIN2 | AIN1 | E1 | AIN2 | PWA | TB12 | TXB | RXB | TR1 | 苏铭
